# EAGLE design InkTime (EAGLE 9.7.0)

## Sheet 1 of 2
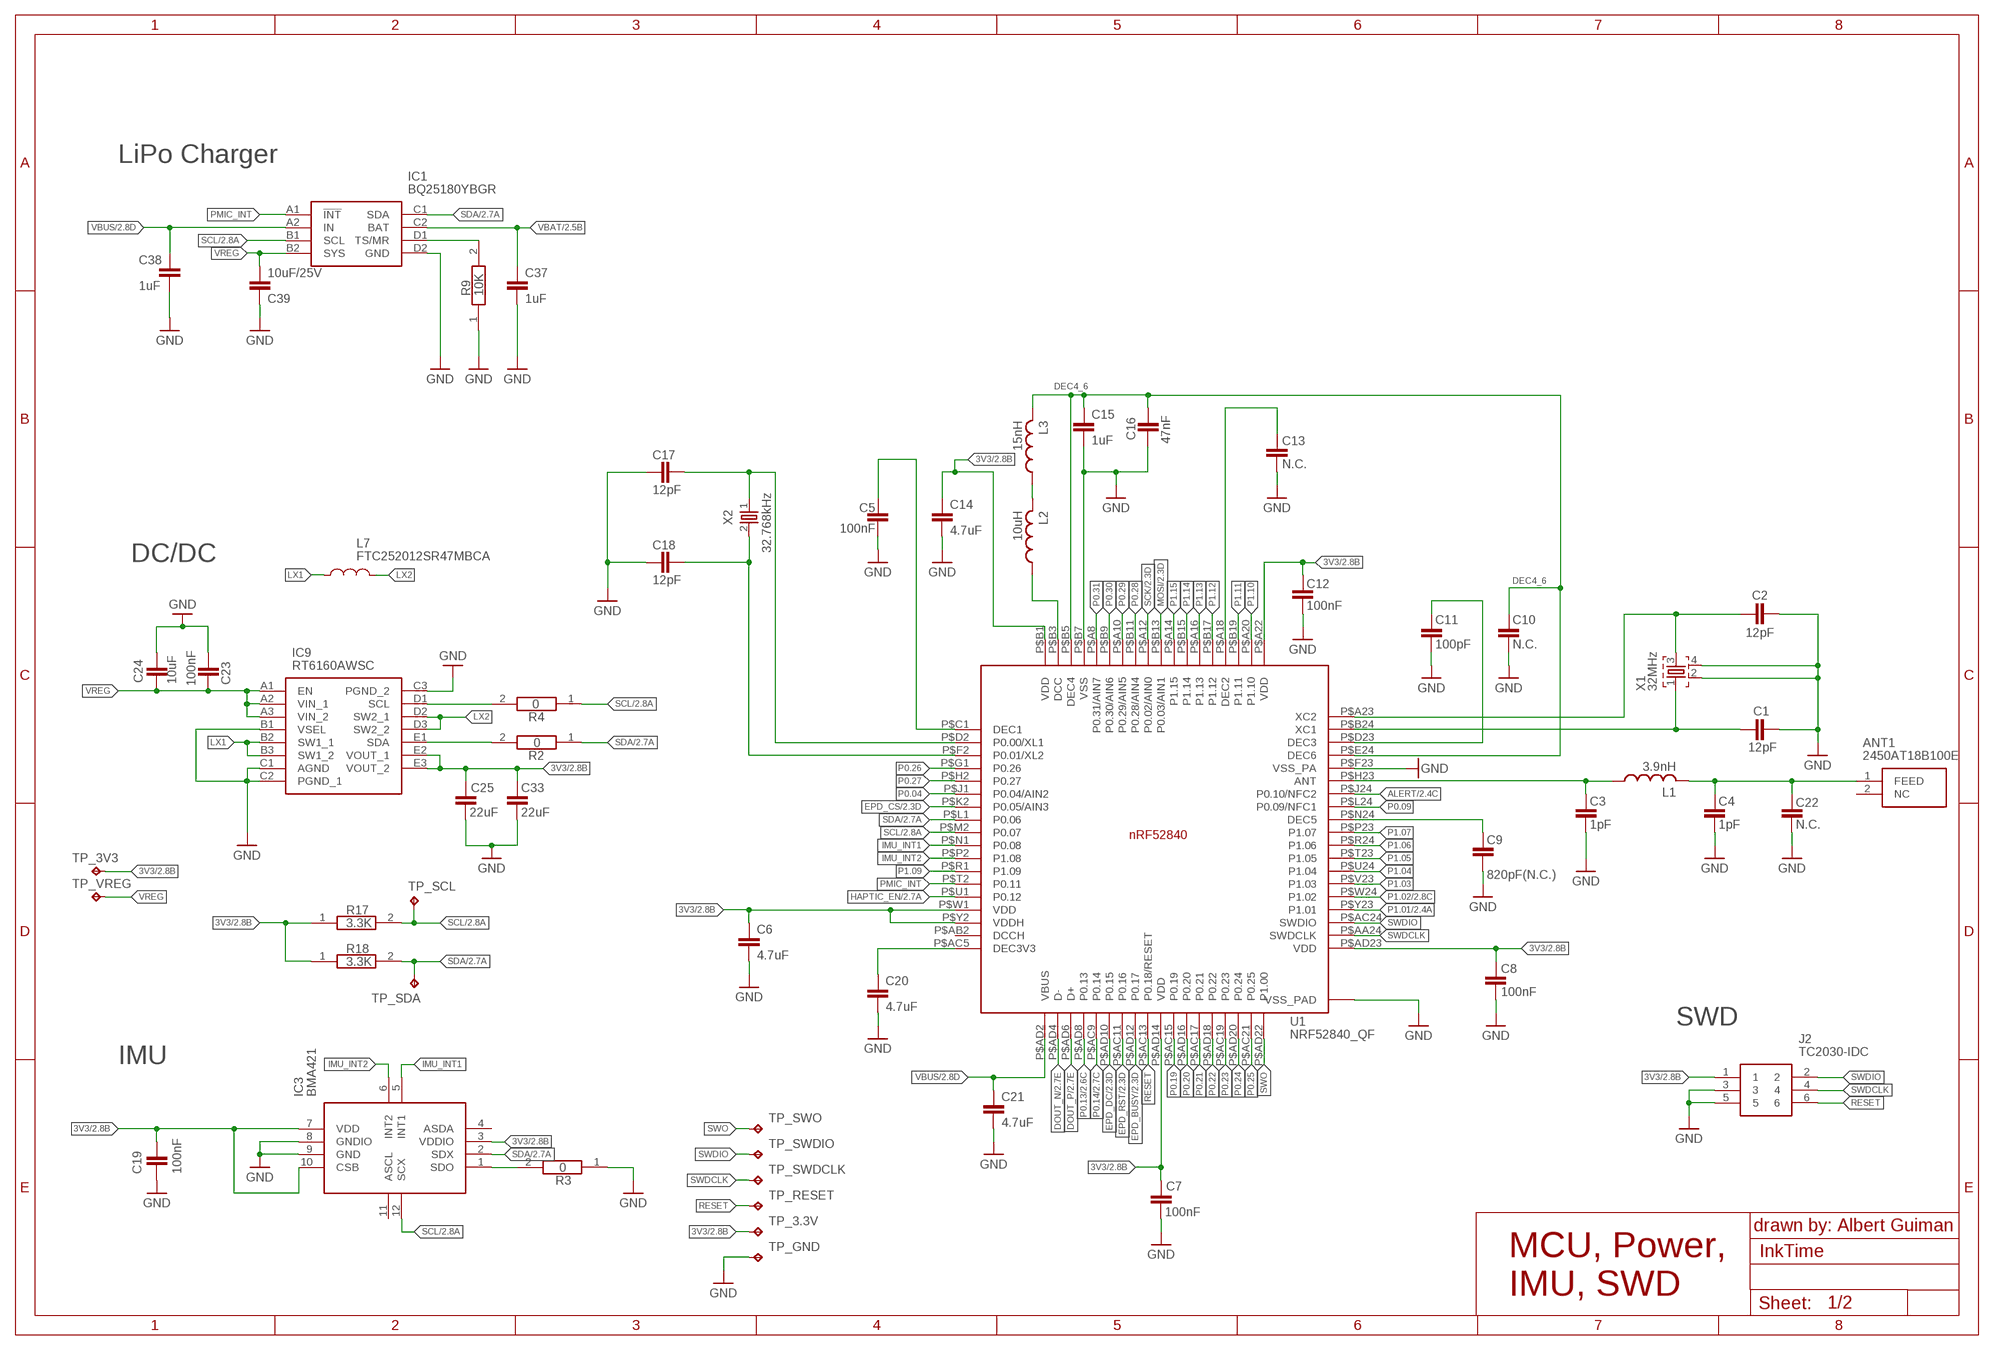
[diagram p0: schematic, sheet 1]
FRAME1 (FRAMES_A3L-LOC): A: a

### Parts
ANT1  2450AT18B100E  2450AT18B100E_2450AT18B100E  [2450AT18B100E_ANTC3216X140N]
C1  12pF  NORDIC_NRF_3_CAPACITOR_0201_N  [NORDIC_NRF_3_RESC0201_N]
C2  12pF  NORDIC_NRF_3_CAPACITOR_0201_N  [NORDIC_NRF_3_RESC0201_N]
C3  1pF  NORDIC_NRF_3_CAPACITOR_0201_N  [NORDIC_NRF_3_RESC0201_N]
C4  1pF  NORDIC_NRF_3_CAPACITOR_0201_N  [NORDIC_NRF_3_RESC0201_N]
C5  100nF  NORDIC_NRF_3_CAPACITOR_0201_N  [NORDIC_NRF_3_RESC0201_N]
C6  4.7uF  NORDIC_NRF_3_CAPACITOR_0402_N  [NORDIC_NRF_3_RESC0402_N]
C7  100nF  NORDIC_NRF_3_CAPACITOR_0201_N  [NORDIC_NRF_3_RESC0201_N]
C8  100nF  NORDIC_NRF_3_CAPACITOR_0201_N  [NORDIC_NRF_3_RESC0201_N]
C9  820pF(N.C.)  NORDIC_NRF_3_CAPACITOR_0201_N  [NORDIC_NRF_3_RESC0201_N]
C10  N.C.  NORDIC_NRF_3_CAPACITOR_0201_N  [NORDIC_NRF_3_RESC0201_N]
C11  100pF  NORDIC_NRF_3_CAPACITOR_0201_N  [NORDIC_NRF_3_RESC0201_N]
C12  100nF  NORDIC_NRF_3_CAPACITOR_0201_N  [NORDIC_NRF_3_RESC0201_N]
C13  N.C.  NORDIC_NRF_3_CAPACITOR_0201_N  [NORDIC_NRF_3_RESC0201_N]
C14  4.7uF  NORDIC_NRF_3_CAPACITOR_0402_N  [NORDIC_NRF_3_RESC0402_N]
C15  1uF  NORDIC_NRF_3_CAPACITOR_0402_N  [NORDIC_NRF_3_RESC0402_N]
C16  47nF  NORDIC_NRF_3_CAPACITOR_0201_N  [NORDIC_NRF_3_RESC0201_N]
C17  12pF  NORDIC_NRF_3_CAPACITOR_0201_N  [NORDIC_NRF_3_RESC0201_N]
C18  12pF  NORDIC_NRF_3_CAPACITOR_0201_N  [NORDIC_NRF_3_RESC0201_N]
C19  100nF  NORDIC_NRF_3_CAPACITOR_0201_N  [NORDIC_NRF_3_RESC0201_N]
C20  4.7uF  NORDIC_NRF_3_CAPACITOR_0402_N  [NORDIC_NRF_3_RESC0402_N]
C21  4.7uF  NORDIC_NRF_3_CAPACITOR_0402_N  [NORDIC_NRF_3_RESC0402_N]
C22  N.C.  NORDIC_NRF_3_CAPACITOR_0201_N  [NORDIC_NRF_3_RESC0201_N]
C23  100nF  NORDIC_NRF_3_CAPACITOR_0201_N  [NORDIC_NRF_3_RESC0201_N]
C24  10uF  NORDIC_NRF_3_CAPACITOR_0402_N  [NORDIC_NRF_3_RESC0402_N]
C25  22uF  NORDIC_NRF_3_CAPACITOR_0603_N  [NORDIC_NRF_3_RESC0603_N]
C33  22uF  NORDIC_NRF_3_CAPACITOR_0603_N  [NORDIC_NRF_3_RESC0603_N]
C37  1uF  NORDIC_NRF_3_CAPACITOR_0402_N  [NORDIC_NRF_3_RESC0402_N]
C38  1uF  NORDIC_NRF_3_CAPACITOR_0402_N  [NORDIC_NRF_3_RESC0402_N]
C39  10uF/25V  NORDIC_NRF_3_CAPACITOR_0603_N  [NORDIC_NRF_3_RESC0603_N]
IC1  BQ25180YBGR  BQ25180YBGR_BQ25180YBGR  [BQ25180YBGR_BGA8C40P2X4_100X155X50]
IC3  BMA421  BMA423_BMA423  [BMA423_BMA423]
IC9  RT6160AWSC  RT6160AWSC_RT6160AWSC  [RT6160AWSC_BGA15C40P3X5_140X230X60]
J2  TC2030-IDC  TC2030-IDC_TC2030-IDC  [TC2030-IDC_TC2030IDC]
L1  3.9nH  NORDIC_NRF_2_INDUCTOR_0201_N  [NORDIC_NRF_2_RESC0201_N]
L2  10uH  NORDIC_NRF_2_INDUCTOR_0603_N  [NORDIC_NRF_2_RESC0603_N]
L3  15nH  NORDIC_NRF_2_INDUCTOR_0402_N  [NORDIC_NRF_2_RESC0402_N]
L7  FTC252012SR47MBCA  FTC252012SR47MBCAFTC252012SR47MBCA  [FTC252012SR47MBCA]
R2  0  ERA-1AEB3401C_CPF0201D7K68C1  [ERA-1AEB3401C_0201]
R3  0  ERA-1AEB3401C_CPF0201D7K68C1  [ERA-1AEB3401C_0201]
R4  0  ERA-1AEB3401C_CPF0201D7K68C1  [ERA-1AEB3401C_0201]
R9  10K  ERA-1AEB3401C_CPF0201D7K68C1  [ERA-1AEB3401C_0201]
R17  3.3K  ERA-1AEB3401C_CPF0201D7K68C1  [ERA-1AEB3401C_0201]
R18  3.3K  ERA-1AEB3401C_CPF0201D7K68C1  [ERA-1AEB3401C_0201]
TP_3.3V  HECTOR_WATCH_1_TPTP20R  [HECTOR_WATCH_1_TP20R]
TP_3V3  HECTOR_WATCH_1_TPTP20R  [HECTOR_WATCH_1_TP20R]
TP_GND  HECTOR_WATCH_1_TPTP20R  [HECTOR_WATCH_1_TP20R]
TP_RESET  HECTOR_WATCH_1_TPTP20R  [HECTOR_WATCH_1_TP20R]
TP_SCL  HECTOR_WATCH_1_TPTP20R  [HECTOR_WATCH_1_TP20R]
TP_SDA  HECTOR_WATCH_1_TPTP20R  [HECTOR_WATCH_1_TP20R]
TP_SWDCLK  HECTOR_WATCH_1_TPTP20R  [HECTOR_WATCH_1_TP20R]
TP_SWDIO  HECTOR_WATCH_1_TPTP20R  [HECTOR_WATCH_1_TP20R]
TP_SWO  HECTOR_WATCH_1_TPTP20R  [HECTOR_WATCH_1_TP20R]
TP_VREG  HECTOR_WATCH_1_TPTP20R  [HECTOR_WATCH_1_TP20R]
U1  NRF52840_QF  NORDIC_NRF_4_NRF52840_QF  [NORDIC_NRF_4_AQFN50P700X700X85_HS-74N]
X1  32MHz  NORDIC_NRF_XTAL_32MHZ  [NORDIC_NRF_BT-XTAL_2016_N]
X2  32.768kHz  NORDIC_NRF_1_XTAL_32KHZ  [NORDIC_NRF_1_XTAL_3215_N]

### Nets
3V3 [HIGH_CURRENT]: C6.1 C7.2 C8.2 C12.2 C14.1 C19.2 C25.1 C33.1 IC3.3(VDDIO) IC3.7(VDD) IC3.10(CSB) IC9.E2(VOUT_1) IC9.E3(VOUT_2) J2.1 R17.1 R18.1 TP_3.3V.TP TP_3V3.TP U1.P$A22(VDD) U1.P$AD14(VDD) U1.P$AD23(VDD) U1.P$B1(VDD) U1.P$W1(VDD) U1.P$Y2(VDDH) ; also sheet 2
ALERT: U1.P$J24(P0.10/NFC2) ; also sheet 2
DEC4_6: C10.2 C15.1 C16.2 L3.2 U1.P$B5(DEC4) U1.P$E24(DEC6)
DOUT_N: U1.P$AD4(D-) ; also sheet 2
DOUT_P: U1.P$AD6(D+) ; also sheet 2
EPD_BUSY: U1.P$AD12(P0.17) ; also sheet 2
EPD_CS: U1.P$K2(P0.05/AIN3) ; also sheet 2
EPD_DC: U1.P$AD10(P0.15) ; also sheet 2
EPD_RST: U1.P$AC11(P0.16) ; also sheet 2
GND [GROUND]: C1.2 C2.2 C3.1 C4.1 C5.1 C6.2 C7.1 C8.1 C9.1 C10.1 C11.1 C12.1 C13.1 C14.2 C15.2 C16.1 C17.1 C18.1 C19.1 C20.2 C21.2 C22.1 C23.1 C24.1 C25.2 C33.2 C37.2 C38.2 C39.2 IC1.D2(GND) IC3.8(GNDIO) IC3.9(GND) IC9.B1(VSEL) IC9.C1(AGND) IC9.C2(PGND_1) IC9.C3(PGND_2) J2.3 J2.5 R3.1 R9.1 TP_GND.TP U1.P$74(VSS_PAD) U1.P$75(VSS_PAD) U1.P$76(VSS_PAD) U1.P$77(VSS_PAD) U1.P$78(VSS_PAD) U1.P$79(VSS_PAD) U1.P$80(VSS_PAD) U1.P$81(VSS_PAD) U1.P$82(VSS_PAD) U1.P$83(VSS_PAD) U1.P$84(VSS_PAD) U1.P$85(VSS_PAD) U1.P$86(VSS_PAD) U1.P$87(VSS_PAD) U1.P$88(VSS_PAD) U1.P$89(VSS_PAD) U1.P$90(VSS_PAD) U1.P$B7(VSS) U1.P$F23(VSS_PA) X1.2 X1.4 ; also sheet 2
HAPTIC_EN: U1.P$U1(P0.12) ; also sheet 2
IMU_INT1: IC3.5(INT1) U1.P$N1(P0.08)
IMU_INT2: IC3.6(INT2) U1.P$P2(P1.08)
LX1: IC9.B2(SW1_1) IC9.B3(SW1_2) L7.1
LX2: IC9.D2(SW2_1) IC9.D3(SW2_2) L7.2
MOSI: U1.P$B13(P0.03/AIN1) ; also sheet 2
N$3: C17.2 U1.P$D2(P0.00/XL1) X2.1
N$5: C20.1 U1.P$AC5(DEC3V3)
N$15: IC9.D1(SCL) R4.2
N$16: C18.2 U1.P$F2(P0.01/XL2) X2.2
N$17: C5.2 U1.P$C1(DEC1)
N$19: IC3.1(SDO) R3.2
N$20: IC9.E1(SDA) R2.2
N$21: L2.2 L3.1
N$22: C2.1 U1.P$A23(XC2) X1.3
N$24: IC1.D1(TS/MR) R9.2
N$25: C13.2 U1.P$A18(DEC2)
N$26: L2.1 U1.P$B3(DCC)
N$27: C11.2 U1.P$D23(DEC3)
N$28: C1.1 U1.P$B24(XC1) X1.1
N$30: C9.2 U1.P$N24(DEC5)
N$32: C3.2 L1.1 U1.P$H23(ANT)
N$33: ANT1.1(FEED) C4.2 C22.2 L1.2
P0.04: U1.P$J1(P0.04/AIN2)
P0.09: U1.P$L24(P0.09/NFC1)
P0.13: U1.P$AD8(P0.13) ; also sheet 2
P0.14: U1.P$AC9(P0.14) ; also sheet 2
P0.19: U1.P$AC15(P0.19)
P0.20: U1.P$AD16(P0.20)
P0.21: U1.P$AC17(P0.21)
P0.22: U1.P$AD18(P0.22)
P0.23: U1.P$AC19(P0.23)
P0.24: U1.P$AD20(P0.24)
P0.25: U1.P$AC21(P0.25)
P0.26: U1.P$G1(P0.26)
P0.27: U1.P$H2(P0.27)
P0.28: U1.P$B11(P0.28/AIN4)
P0.29: U1.P$A10(P0.29/AIN5)
P0.30: U1.P$B9(P0.30/AIN6)
P0.31: U1.P$A8(P0.31/AIN7)
P1.01: U1.P$Y23(P1.01) ; also sheet 2
P1.02: U1.P$W24(P1.02) ; also sheet 2
P1.03: U1.P$V23(P1.03)
P1.04: U1.P$U24(P1.04)
P1.05: U1.P$T23(P1.05)
P1.06: U1.P$R24(P1.06)
P1.07: U1.P$P23(P1.07)
P1.09: U1.P$R1(P1.09)
P1.10: U1.P$A20(P1.10)
P1.11: U1.P$B19(P1.11)
P1.12: U1.P$B17(P1.12)
P1.13: U1.P$A16(P1.13)
P1.14: U1.P$B15(P1.14)
P1.15: U1.P$A14(P1.15)
PMIC_INT: IC1.A1(!INT) U1.P$T2(P0.11)
RESET: J2.6 TP_RESET.TP U1.P$AC13(P0.18/RESET)
SCK: U1.P$A12(P0.02/AIN0) ; also sheet 2
SCL: IC1.B1(SCL) IC3.12(SCX) R4.1 R17.2 TP_SCL.TP U1.P$M2(P0.07) ; also sheet 2
SDA: IC1.C1(SDA) IC3.2(SDX) R2.1 R18.2 TP_SDA.TP U1.P$L1(P0.06) ; also sheet 2
SWDCLK: J2.4 TP_SWDCLK.TP U1.P$AA24(SWDCLK)
SWDIO: J2.2 TP_SWDIO.TP U1.P$AC24(SWDIO)
SWO: TP_SWO.TP U1.P$AD22(P1.00)
VBAT [HIGH_CURRENT]: C37.1 IC1.C2(BAT) ; also sheet 2
VBUS [HIGH_CURRENT]: C21.1 C38.1 IC1.A2(IN) U1.P$AD2(VBUS) ; also sheet 2
VREG [HIGH_CURRENT]: C23.2 C24.2 C39.1 IC1.B2(SYS) IC9.A1(EN) IC9.A2(VIN_1) IC9.A3(VIN_2) TP_VREG.TP
Unconnected: ANT1.2(NC) IC3.4(ASDA) IC3.11(ASCL) U1.P$AB2(DCCH)

### Notes on the sheet
- LiPo Charger
- DC/DC
- SWD
- IMU
- drawn by: Albert Guiman
- MCU, Power,
  IMU, SWD

## Sheet 2 of 2
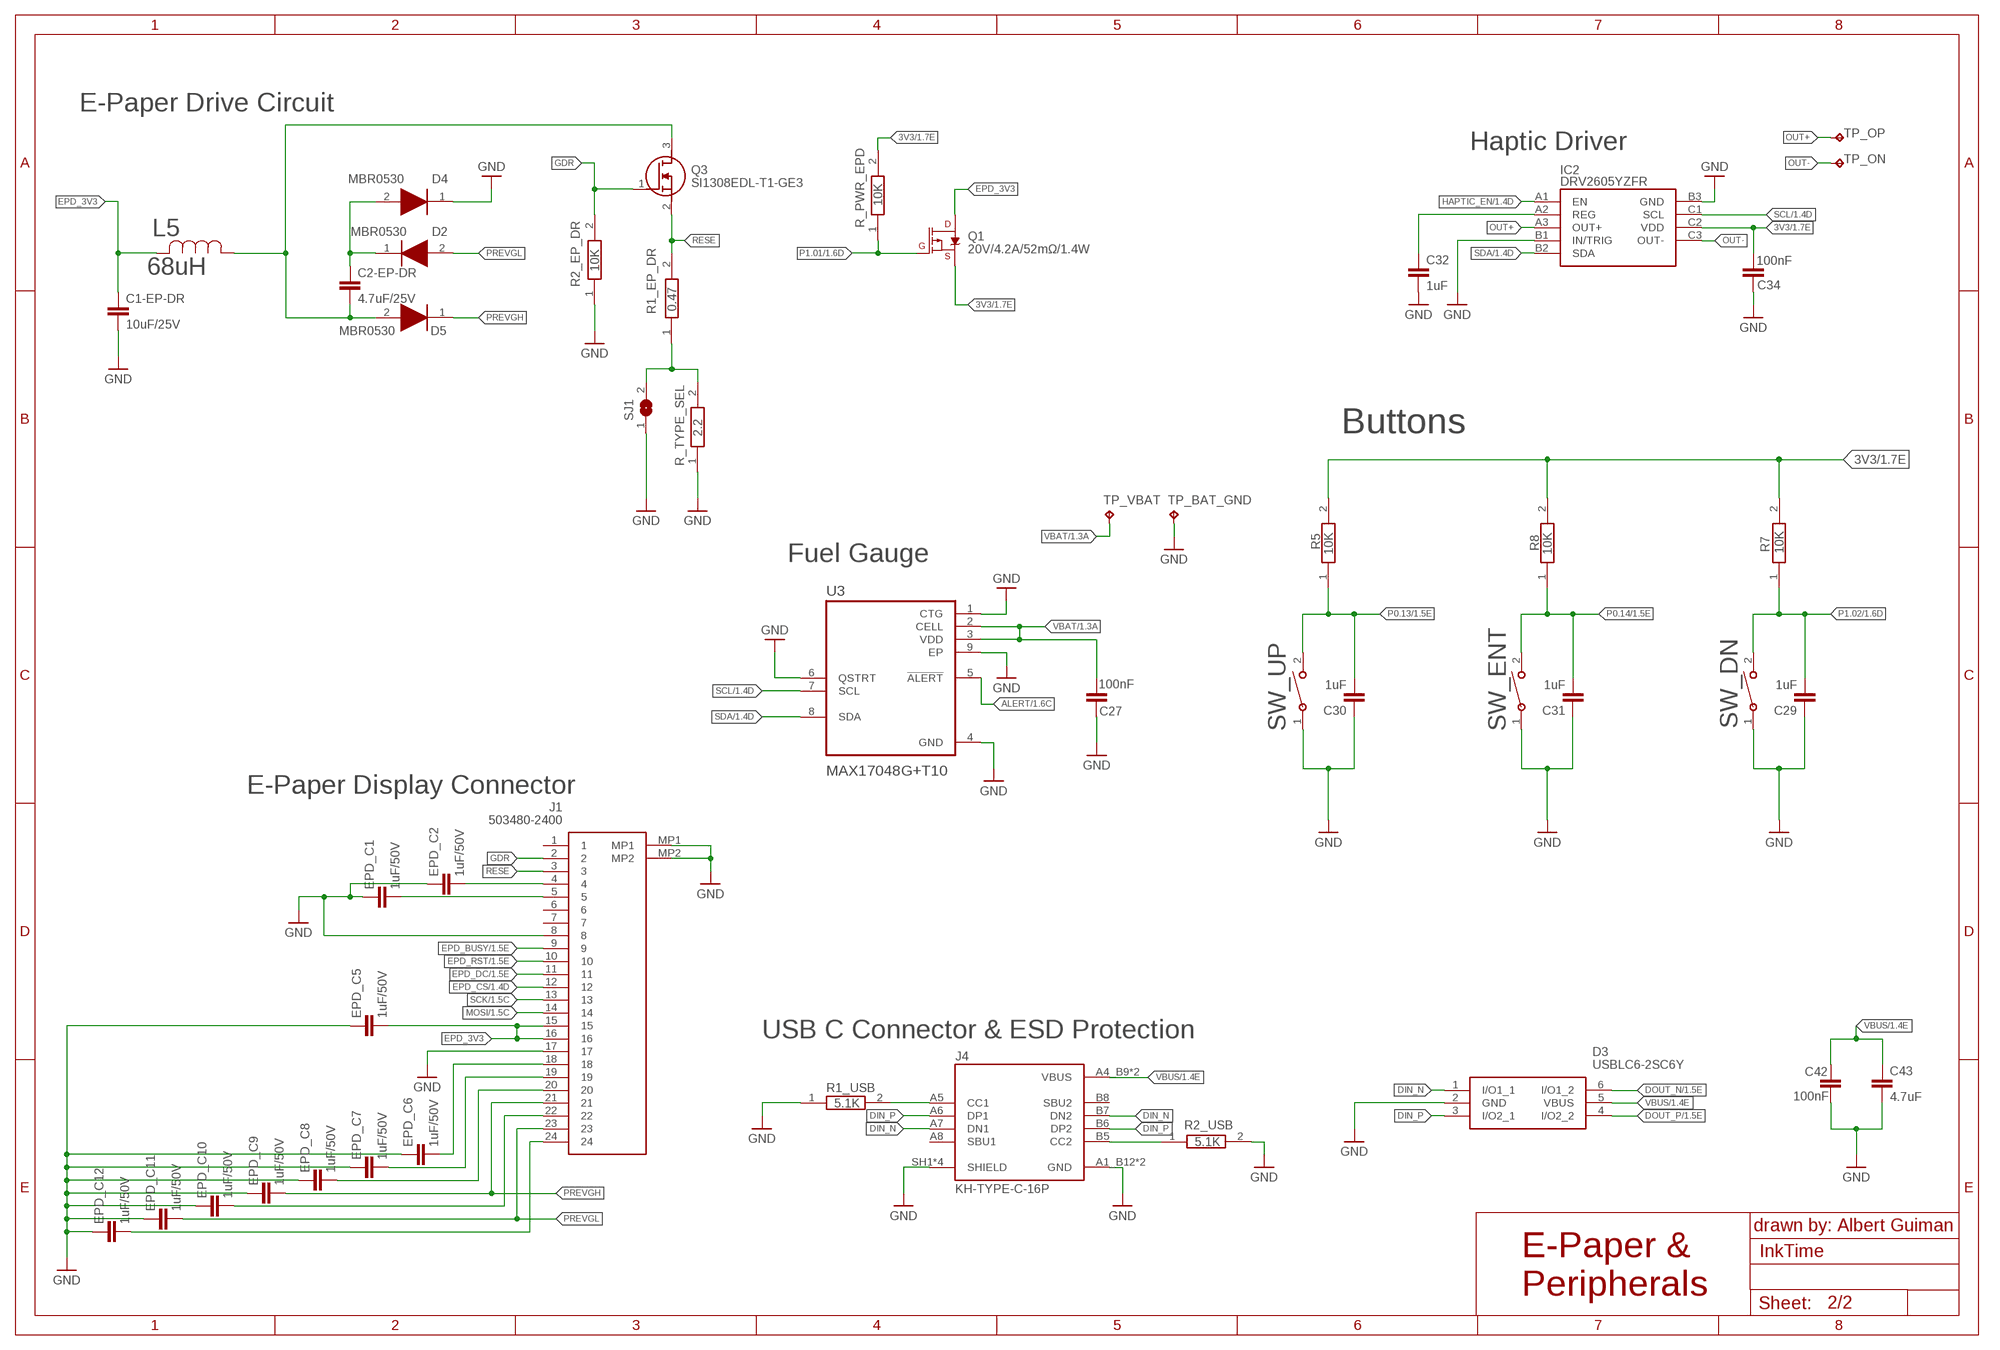
[diagram p1: schematic, sheet 2]

### Parts
C1-EP-DR  10uF/25V  NORDIC_NRF_3_CAPACITOR_0603_N  [NORDIC_NRF_3_RESC0603_N]
C2-EP-DR  4.7uF/25V  PERFECT_0402_CAP_0402  [PERFECT_0402_0402]
C27  100nF  NORDIC_NRF_3_CAPACITOR_0201_N  [NORDIC_NRF_3_RESC0201_N]
C29  1uF  PERFECT_0402_CAP_0402  [PERFECT_0402_0402]
C30  1uF  PERFECT_0402_CAP_0402  [PERFECT_0402_0402]
C31  1uF  PERFECT_0402_CAP_0402  [PERFECT_0402_0402]
C32  1uF  PERFECT_0402_CAP_0402  [PERFECT_0402_0402]
C34  100nF  NORDIC_NRF_3_CAPACITOR_0201_N  [NORDIC_NRF_3_RESC0201_N]
C42  100nF  NORDIC_NRF_3_CAPACITOR_0201_N  [NORDIC_NRF_3_RESC0201_N]
C43  4.7uF  PERFECT_0402_CAP_0402  [PERFECT_0402_0402]
D2  MBR0530  ESP32_C6_LIBRARY_5_MBR0530  [ESP32_C6_LIBRARY_5_SOD3716X135N]
D3  USBLC6-2SC6Y  ESP32_C6_LIBRARY_3_USBLC6-2SC6Y  [ESP32_C6_LIBRARY_3_SOT95P280X145-6N]
D4  MBR0530  ESP32_C6_LIBRARY_5_MBR0530  [ESP32_C6_LIBRARY_5_SOD3716X135N]
D5  MBR0530  ESP32_C6_LIBRARY_5_MBR0530  [ESP32_C6_LIBRARY_5_SOD3716X135N]
EPD_C1  1uF/50V  PERFECT_0402_CAP_0402  [PERFECT_0402_0402]
EPD_C2  1uF/50V  PERFECT_0402_CAP_0402  [PERFECT_0402_0402]
EPD_C5  1uF/50V  PERFECT_0402_CAP_0402  [PERFECT_0402_0402]
EPD_C6  1uF/50V  PERFECT_0402_CAP_0402  [PERFECT_0402_0402]
EPD_C7  1uF/50V  PERFECT_0402_CAP_0402  [PERFECT_0402_0402]
EPD_C8  1uF/50V  PERFECT_0402_CAP_0402  [PERFECT_0402_0402]
EPD_C9  1uF/50V  PERFECT_0402_CAP_0402  [PERFECT_0402_0402]
EPD_C10  1uF/50V  PERFECT_0402_CAP_0402  [PERFECT_0402_0402]
EPD_C11  1uF/50V  PERFECT_0402_CAP_0402  [PERFECT_0402_0402]
EPD_C12  1uF/50V  PERFECT_0402_CAP_0402  [PERFECT_0402_0402]
IC2  DRV2605YZFR  DRV2605YZFR_DRV2605YZFR  [DRV2605YZFR_BGA9C50P3X3_144X144X62]
J1  503480-2400  503480-2400_503480-2400  [503480-2400_5034802400]
J4  KH-TYPE-C-16P  KH-TYPE-C-16P_KH-TYPE-C-16P  [KH-TYPE-C-16P_KINGHELM_KH-TYPE-C-16P]
L5  68uH  ESP32_C6_LIBRARY_2_744043680IND_4828-WE-TPC_WRE  [ESP32_C6_LIBRARY_2_IND_4828-WE-TPC_WRE]
Q1  20V/4.2A/52mΩ/1.4W  ESP32_C6_LIBRARY_4_ESP32_WROVER_SPARKFUN-DISCRETESEMI_MOSFET_PCH-DMG2305UX-7  [ESP32_C6_LIBRARY_4_ESP32_C6_LIBRARY_4_ESP32_C6_LIBRARY_4_ESP32_C6_LIBRARY_4_ESP32_WROVER_SPARKFUN-DISCRETESEMI_SOT23-3]
Q3  SI1308EDL-T1-GE3  ESP32_C6_LIBRARY_6_SI1308EDL-T1-GE3  [ESP32_C6_LIBRARY_6_SOT65P210X110-3N]
R1_EP_DR  0.47  ERA-1AEB3401C_CPF0201D7K68C1  [ERA-1AEB3401C_0201]
R1_USB  5.1K  ERA-1AEB3401C_CPF0201D7K68C1  [ERA-1AEB3401C_0201]
R2_EP_DR  10K  ERA-1AEB3401C_CPF0201D7K68C1  [ERA-1AEB3401C_0201]
R2_USB  5.1K  ERA-1AEB3401C_CPF0201D7K68C1  [ERA-1AEB3401C_0201]
R5  10K  ERA-1AEB3401C_CPF0201D7K68C1  [ERA-1AEB3401C_0201]
R7  10K  ERA-1AEB3401C_CPF0201D7K68C1  [ERA-1AEB3401C_0201]
R8  10K  ERA-1AEB3401C_CPF0201D7K68C1  [ERA-1AEB3401C_0201]
R_PWR_EPD  10K  ERA-1AEB3401C_CPF0201D7K68C1  [ERA-1AEB3401C_0201]
R_TYPE_SEL  2.2  ERA-1AEB3401C_CPF0201D7K68C1  [ERA-1AEB3401C_0201]
SJ1  ESP32_C6_LIBRARY_7_JUMPER_SJ  [ESP32_C6_LIBRARY_7_JUMPER_SJ]
SW_DN  2025-10-22_07-23-44_LIBRARY_EVP-AKE31ASW_EVP-AKE31A_PAN  [2025-10-22_07-23-44_LIBRARY_SW_EVP-AKE31A_PAN]
SW_ENT  2025-10-22_07-23-44_LIBRARY_EVP-AKE31ASW_EVP-AKE31A_PAN  [2025-10-22_07-23-44_LIBRARY_SW_EVP-AKE31A_PAN]
SW_UP  2025-10-22_07-23-44_LIBRARY_EVP-AKE31ASW_EVP-AKE31A_PAN  [2025-10-22_07-23-44_LIBRARY_SW_EVP-AKE31A_PAN]
TP_BAT_GND  HECTOR_WATCH_1_TPTP20R  [HECTOR_WATCH_1_TP20R]
TP_ON  HECTOR_WATCH_1_TPTP20R  [HECTOR_WATCH_1_TP20R]
TP_OP  HECTOR_WATCH_1_TPTP20R  [HECTOR_WATCH_1_TP20R]
TP_VBAT  HECTOR_WATCH_1_TPTP20R  [HECTOR_WATCH_1_TP20R]
U3  MAX17048G+T10  ESP32_C6_LIBRARY_MAX17048G+T10  [ESP32_C6_LIBRARY_SON50P200X200X80-9N]

### Nets
3V3 [HIGH_CURRENT]: C34.2 IC2.C2(VDD) Q1.2(S) R5.2 R7.2 R8.2 R_PWR_EPD.2 ; also sheet 1
ALERT: U3.5(!ALERT) ; also sheet 1
DIN_N: D3.1(I/O1_1) J4.A7(DN1) J4.B7(DN2)
DIN_P: D3.3(I/O2_1) J4.A6(DP1) J4.B6(DP2)
DOUT_N: D3.6(I/O1_2) ; also sheet 1
DOUT_P: D3.4(I/O2_2) ; also sheet 1
EPD_3V3 [HIGH_CURRENT]: C1-EP-DR.1 EPD_C5.2 J1.15 J1.16 L5.2 Q1.3(D)
EPD_BUSY: J1.9 ; also sheet 1
EPD_CS: J1.12 ; also sheet 1
EPD_DC: J1.11 ; also sheet 1
EPD_RST: J1.10 ; also sheet 1
GDR: J1.2 Q3.1(G) R2_EP_DR.2
GND [GROUND]: C1-EP-DR.2 C27.1 C29.1 C30.1 C31.1 C32.2 C34.1 C42.2 C43.2 D3.2(GND) D4.1(K) EPD_C1.1 EPD_C2.1 EPD_C5.1 EPD_C6.1 EPD_C7.1 EPD_C8.1 EPD_C9.1 EPD_C10.1 EPD_C11.1 EPD_C12.1 IC2.B1(IN/TRIG) IC2.B3(GND) J1.8 J1.17 J1.MP1 J1.MP2 J4.A1_B12(GND) J4.A12_B1(GND) J4.SH1(SHIELD) J4.SH2(SHIELD) J4.SH3(SHIELD) J4.SH4(SHIELD) R1_USB.1 R2_EP_DR.1 R2_USB.2 R_TYPE_SEL.1 SJ1.1 SW_DN.1 SW_ENT.1 SW_UP.1 TP_BAT_GND.TP U3.1(CTG) U3.4(GND) U3.6(QSTRT) U3.9(EP) ; also sheet 1
HAPTIC_EN: IC2.A1(EN) ; also sheet 1
MOSI: J1.14 ; also sheet 1
N$1: J4.A5(CC1) R1_USB.2
N$2: EPD_C12.2 J1.24
N$4: EPD_C2.2 J1.4
N$6: EPD_C1.2 J1.5
N$7: EPD_C10.2 J1.22
N$8: J4.B5(CC2) R2_USB.1
N$9: C32.1 IC2.A2(REG)
N$10: EPD_C8.2 J1.20
N$11: EPD_C7.2 J1.19
N$12: EPD_C6.2 J1.18
N$13: C2-EP-DR.2 D5.2(A) L5.1 Q3.3(D)
N$14: C2-EP-DR.1 D2.1(K) D4.2(A)
N$18: R1_EP_DR.1 R_TYPE_SEL.2 SJ1.2
OUT+: IC2.A3(OUT+) TP_OP.TP
OUT-: IC2.C3(OUT-) TP_ON.TP
P0.13: C30.2 R5.1 SW_UP.2 ; also sheet 1
P0.14: C31.2 R8.1 SW_ENT.2 ; also sheet 1
P1.01: Q1.1(G) R_PWR_EPD.1 ; also sheet 1
P1.02: C29.2 R7.1 SW_DN.2 ; also sheet 1
PREVGH: D5.1(K) EPD_C9.2 J1.21
PREVGL: D2.2(A) EPD_C11.2 J1.23
RESE: J1.3 Q3.2(S) R1_EP_DR.2
SCK: J1.13 ; also sheet 1
SCL: IC2.C1(SCL) U3.7(SCL) ; also sheet 1
SDA: IC2.B2(SDA) U3.8(SDA) ; also sheet 1
VBAT [HIGH_CURRENT]: C27.2 TP_VBAT.TP U3.2(CELL) U3.3(VDD) ; also sheet 1
VBUS [HIGH_CURRENT]: C42.1 C43.1 D3.5(VBUS) J4.A4_B9(VBUS) J4.A9_B4(VBUS) ; also sheet 1
Unconnected: J1.1 J1.6 J1.7 J4.A8(SBU1) J4.B8(SBU2)

### Notes on the sheet
- E-Paper Drive Circuit
- Haptic Driver
- Buttons
- Fuel Gauge
- E-Paper Display Connector
- USB C Connector & ESD Protection
- drawn by: Albert Guiman
- E-Paper &
  Peripherals

## Library data of the parts
ANT1 = InkTime_v5:2450AT18B100E_2450AT18B100E: Antennas 2.45GHz ANTENNA Source: Datasheet <https://www.johansontechnology.com/datasheets/2450AT18B100/2450AT18B100.pdf>
C1 C1-EP-DR C2-C25 C27 C33 C34 C37-C39 C42 = InkTime_v5:NORDIC_NRF_3_CAPACITOR: Generic chip capacitor
C2-EP-DR C29-C32 C43 EPD_C1 EPD_C2 EPD_C5-EPD_C12 = InkTime_v5:PERFECT_0402_CAP_0402: 0402 (1005 Metric) Nick Garner - TeleSense
D2 D4 D5 = InkTime_v5:ESP32_C6_LIBRARY_5_MBR0530: ON SEMICONDUCTOR - MBR0530 - DIODE, SCHOTTKY, 0.5A, 30V, SOD-123 Source: Datasheet <http://www.onsemi.com/pub/Collateral/MBR0530T1-D.PDF> Check availability <https://pricing.snapeda.com/parts/MBR0530/ON%20Semiconductor/view-part?ref=eda>
D3 = InkTime_v5:ESP32_C6_LIBRARY_3_USBLC6-2SC6Y: Low Cap. ESD Protection Auto SOT-23-6 STMicroelectronics USBLC6-2SC6Y, Dual Uni-Directional TVS Diode Array, 6-Pin SOT-23 Source: Datasheet <https://componentsearchengine.com/Datasheets/1/USBLC6-2SC6Y.pdf> Check availability <https://pricing.snapeda.com/parts/USBLC6-2SC6Y/STMicroelectronics/view-part?ref=eda>
IC1 = InkTime_v5:BQ25180YBGR_BQ25180YBGR: Charger IC Lithium Ion/Polymer, Lithium Iron Phosphate 8-DSBGA (1.6x1.1) Source: Datasheet <https://www.ti.com/lit/ds/symlink/bq25180.pdf?ts=1650264094470&ref_url=https%3A%2F%2Fwww.ti.com%2Fproduct%2FBQ25180>
IC2 = InkTime_v5:DRV2605YZFR_DRV2605YZFR: Haptic Driver for ERM/LRA with Built-In Library and Smart Loop Architecture Source: Datasheet <http://www.ti.com/lit/gpn/drv2605>
IC3 = InkTime_v5:BMA423_BMA423: Accelerometers Triaxial low-g 12bit Acceleration Sensor Source: Datasheet <https://www.mouser.com/datasheet/2/783/BST-BMA423-DS000-1509600.pdf>
IC9 = InkTime_v5:RT6160AWSC_RT6160AWSC: Buck-Boost Regulator Positive Output Step-Up/Step-Down I2C DC-DC Controller IC 15-WL-CSP (BSC) (1.4x2.3) Source: Datasheet <https://www.richtek.com/SaveDownload.aspx?specid=RT6160A>
J1 = InkTime_v5:503480-2400_503480-2400: FFC & FPC Connectors 0.5mm FPC RA SMT Dual Contact 24Ckt Source: Datasheet <https://componentsearchengine.com/Datasheets/1/503480-2400.pdf>
J2 = InkTime_v5:TC2030-IDC_TC2030-IDC: CABLE ADAPTER 6 POS Source: Datasheet <https://datasheet.datasheetarchive.com/originals/distributors/Datasheets_SAMA/62bc384e093448baaaa63dbd0b9d8707.pdf>
J4 = InkTime_v5:KH-TYPE-C-16P_KH-TYPE-C-16P: Check availability <https://pricing.snapeda.com/parts/KH-TYPE-C-16P/kinghelm/view-part?ref=eda>
L1-L3 = InkTime_v5:NORDIC_NRF_2_INDUCTOR: Generic chip inductor
L5 = InkTime_v5:ESP32_C6_LIBRARY_2_744043680
L7 = InkTime_v5:FTC252012SR47MBCA
Q1 = InkTime_v5:ESP32_C6_LIBRARY_4_ESP32_WROVER_SPARKFUN-DISCRETESEMI_MOSFET_PCH: P-channel MOSFETs Voltage controlled devices that allow control of high current outputs. SparkFun Products: SparkFun ESP32 Thing <https://www.sparkfun.com/products/13907> SparkFun ESP8266 Thing <https://www.sparkfun.com/products/13231> SparkFun Pi Servo HAT V2 <https://www.sparkfun.com/products/15316> DMG2305UX-7 (20V/4.2A/SOT23-3)
Q3 = InkTime_v5:ESP32_C6_LIBRARY_6_SI1308EDL-T1-GE3: MOSFET N-Ch 30V 1.5A TrenchFET SC70 Vishay Si1308EDL-T1-GE3 N-channel MOSFET Transistor, 1.5 A, 30 V, 3-Pin SC-70 Source: Datasheet <https://componentsearchengine.com/Datasheets/1/SI1308EDL-T1-GE3.pdf> Check availability <https://pricing.snapeda.com/parts/SI1308EDL-T1-GE3/Vishay%20Siliconix/view-part?ref=eda>
R1_EP_DR R1_USB R2 R2_EP_DR R2_USB R3-R5 R7-R9 R17 R18 R_PWR_EPD R_TYPE_SEL = InkTime_v5:ERA-1AEB3401C_CPF0201D7K68C1: 7.68k 0201 Thin Film Surface Mount Fixed Resistor +/-0.5% 0.031W CPF0201D7K68C1 Source: Datasheet <http://www.te.com/commerce/DocumentDelivery/DDEController?Action=showdoc&DocId=Data Sheet1773200-1ApdfEnglishENG_DS_1773200-1_A.pdf4-2176215-6>
SJ1 = InkTime_v5:ESP32_C6_LIBRARY_7_JUMPER_SJ: SMD solder JUMPER
SW_DN SW_ENT SW_UP = InkTime_v5:2025-10-22_07-23-44_LIBRARY_EVP-AKE31A
TP_3.3V TP_3V3 TP_BAT_GND TP_GND TP_ON TP_OP TP_RESET TP_SCL TP_SDA TP_SWDCLK TP_SWDIO TP_SWO TP_VBAT TP_VREG = InkTime_v5:HECTOR_WATCH_1_TP: Test pad
U1 = InkTime_v5:NORDIC_NRF_4_NRF52840_QF: nRF52840 Features Advanced Single chip 2.4 GHz multi-protocol SoC 32-bit ARM Cortex-M4F Processor 1.7v to 5.5v operation 1MB flash + 256kB RAM Bluetooth 5 support for long range and high throughput 802.15.4 radio support On-chip NFC PPI –Programmable Peripheral Interconnect Automated power management system with automatic power management of each peripheral Configurable I/O mapping for analog and digital I/O 48 x GPIO 1 x QSPI 4 x Master/Slave SPI 2 x Two-wire interface (I²C) I²S interface 2 x UART 4 x PWM USB 2.0 controller ARM TrustZone CryptoCell-310 Cryptographic and security module AES 128-bit ECB/CCM/AAR hardware accelerator Digital microphone interface (PDM) Quadrature decoder 12-bit ADC Low power comparator On-chip 50Ω balun On-air compatible with nRF52, nRF51 and nRF24 Series Applications Advanced high performance wearables Wearables for secure payments Virtual Reality/Augmented Reality systems Smart Home sensor networks Smart city sensor networks High performance HID controllers Internet of Things (IoT) sensor networks Smart door locks Smart lighting networks Connected white goods
U3 = InkTime_v5:ESP32_C6_LIBRARY_MAX17048G+T10: Check availability <https://pricing.snapeda.com/parts/MAX17048G%2BT10/Analog%20Devices/view-part?ref=eda>
X1 = InkTime_v5:NORDIC_NRF_XTAL_32MHZ
X2 = InkTime_v5:NORDIC_NRF_1_XTAL_32KHZ

## Net classes
0 default: width 0.15 mm
1 HIGH_CURRENT: width 0.1 mm
2 GROUND: width 0.1 mm

## Board
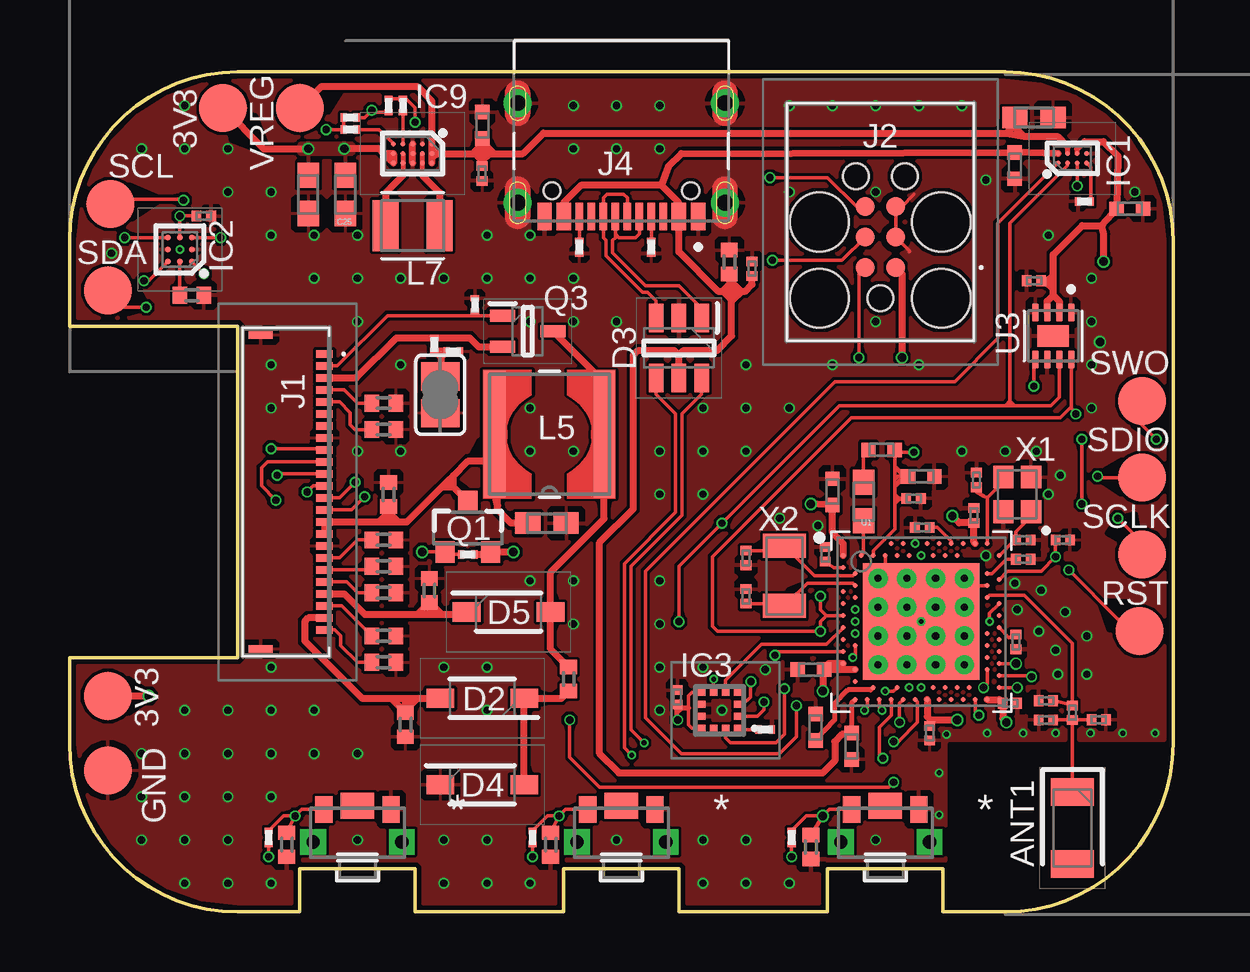
[diagram p2: board, top side]
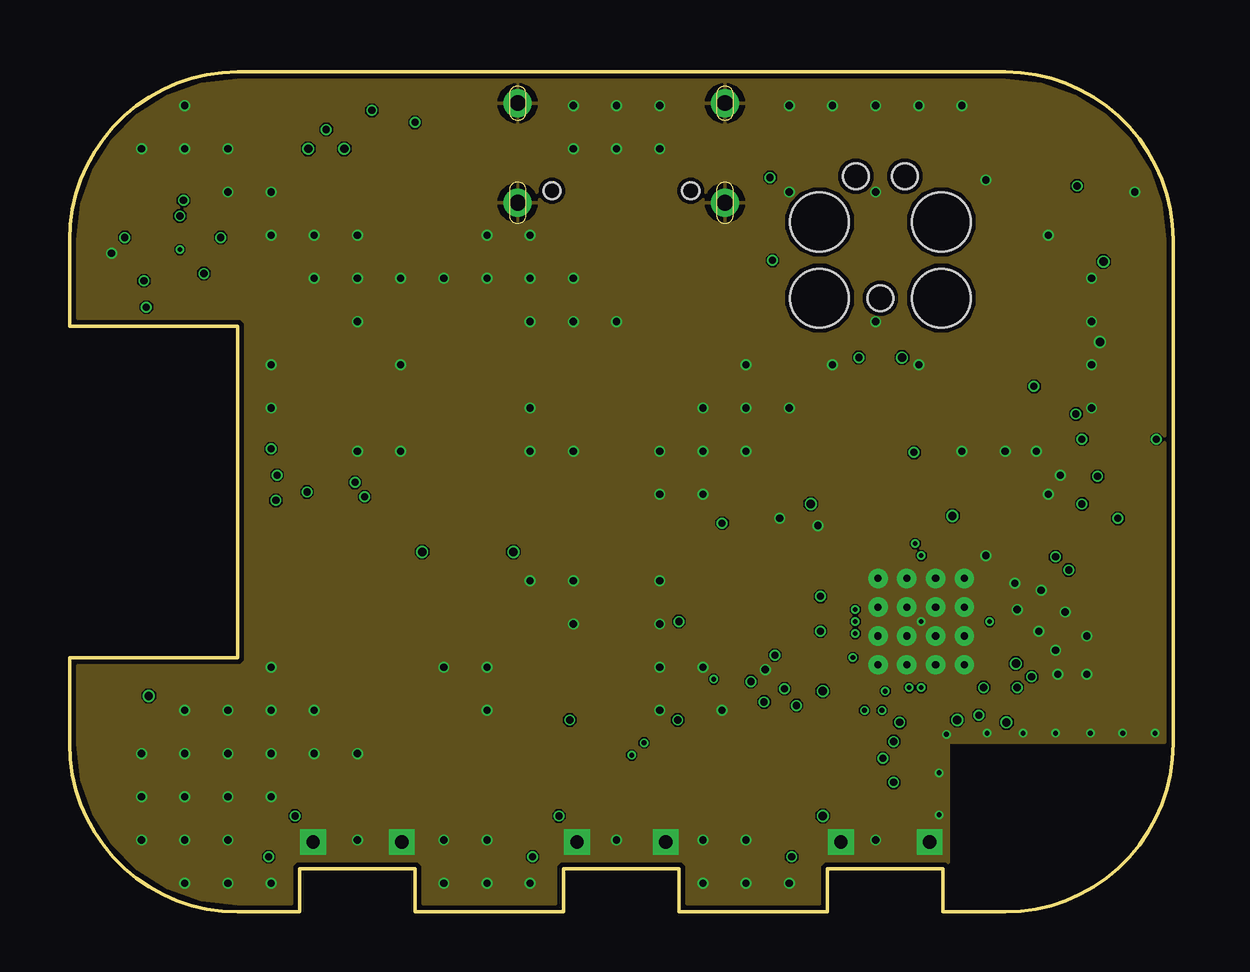
[diagram p3: board, inner layer GND]
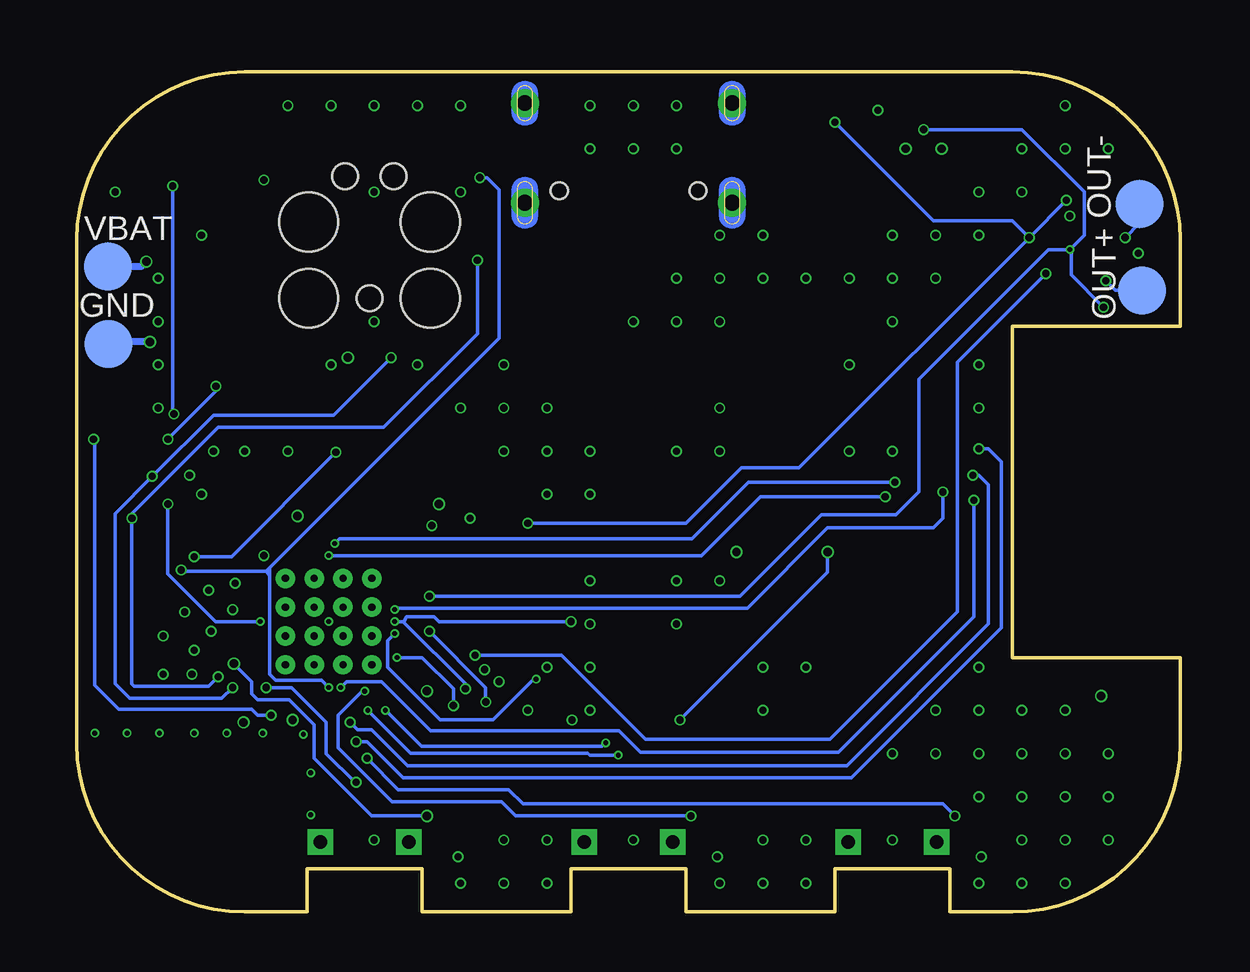
[diagram p4: board, bottom side, seen from below]

Size 46 x 35 mm. Coordinates in mm from the lower left corner, seen from the top.
Outline: 39,0 36.4,0 36.4,1.8 31.6,1.8 31.6,0 25.4,0 25.4,1.8 20.6,1.8 20.6,0 14.4,0 14.4,1.8 9.6,1.8 9.6,0 7,0 arc-90 0,7 0,10.6 7,10.6 7,24.4 0,24.4 0,28 arc-90 7,35 39,35 arc-90 46,28 46,7 arc-90 39,0
Copper layers (1+2*63+16): Top / GND / Bottom / layer 63
Stack-up 4 Layer Stack: Top SilkScreen Epoxy Ink / Top SolderMask User Defined 0.02mm Dk 4.3 / Top Surface Finish Lead-Free 0.02mm / Top User Defined 0.03mm / Dielectric-1 User Defined 0.034mm / Dielectric-2 User Defined 0.034mm / GND User Defined 0.03mm / Dielectric-3 User Defined 0.664mm / Power User Defined 0.03mm / Dielectric-4 User Defined 0.034mm / Dielectric-5 User Defined 0.034mm / Bottom User Defined 0.03mm / Bottom Surface Finish Lead-Free 0.02mm / Bottom SolderMask User Defined 0.02mm Dk 4.3 / Bottom SilkScreen Epoxy Ink
Design rules: minimum copper width classes=0 0.15mm, minimum copper width classes=1 0.1mm, minimum copper width classes=2 0.1mm, minimum copper width 0.15mm, minimum drill size 0.2mm, copper clearance wire_polygon to wire_polygon 5mil, copper clearance wire_polygon to pad_smd 5mil, copper clearance wire_polygon to via 5mil, copper clearance pad_smd to pad_smd 5mil, copper clearance pad_smd to via 5mil, copper clearance via to via 5mil, copper clearance smd to pad (same net) 5mil, copper clearance smd to via (same net) 5mil, copper clearance smd to smd (same net) 5mil, dimension clearance 0.2mm, via restrict clearance 0mil, restrict clearance 0.1mm, drill distance 6mil, keepout clearance 0mil
ComponentExcludeTop: area 36.7,0 to 46,7
ComponentExcludeBottom: area 36.7,0 to 46,7
RestrictTop: area 36.7,0 to 46,7
RestrictBottom: area 36.7,0 to 46,7
RestrictVias: area 36.7,0 to 46,7

### Footprints (pad centres in the part's own frame; a part is rotated, then mirrored left to right if it is on the bottom)
2450AT18B100E_ANTC3216X140N = smd 1.15 x 1.8: 1 -1.5,0; 2 1.5,0
NORDIC_NRF_3_RESC0201_N = smd 0.4 x 0.45: 1 -0.305,0; 2 0.305,0
NORDIC_NRF_3_RESC0603_N = smd 1.05 x 0.9: 1 -0.8,0; 2 0.8,0
PERFECT_0402_0402 = smd 0.6 x 0.7: 1 -0.5,0; 2 0.5,0
NORDIC_NRF_3_RESC0402_N = smd 0.6 x 0.6: 1 -0.55,0; 2 0.55,0
ESP32_C6_LIBRARY_5_SOD3716X135N = smd 1.15 x 0.8: 1 -1.75,0; 2 1.75,0
ESP32_C6_LIBRARY_3_SOT95P280X145-6N = smd 1.2 x 0.6: 1 -1.25,0.95; 2 -1.25,0; 3 -1.25,-0.95; 4 1.25,-0.95; 5 1.25,0; 6 1.25,0.95
BQ25180YBGR_BGA8C40P2X4_100X155X50 = smd 0.2 x 0.2: A1 -0.2,0.6; A2 0.2,0.6; B1 -0.2,0.2; B2 0.2,0.2; C1 -0.2,-0.2; C2 0.2,-0.2; D1 -0.2,-0.6; D2 0.2,-0.6
DRV2605YZFR_BGA9C50P3X3_144X144X62 = smd 0.25 x 0.25: A1 -0.5,0.5; A2 0,0.5; A3 0.5,0.5; B1 -0.5,0; B2 0,0; B3 0.5,0; C1 -0.5,-0.5; C2 0,-0.5; C3 0.5,-0.5
BMA423_BMA423 = smd 0.3 x 0.35: 1 -0.75,-0.775; 2 -0.25,-0.775; 3 0.25,-0.775; 4 0.75,-0.775; 7 0.75,0.775; 8 0.25,0.775; 9 -0.25,0.775; 10 -0.75,0.775 | smd 0.35 x 0.3: 5 0.775,-0.25; 6 0.775,0.25; 11 -0.775,0.25; 12 -0.775,-0.25
RT6160AWSC_BGA15C40P3X5_140X230X60 = smd 0.216 x 0.216: A1 -0.4,0.8; A2 0,0.8; A3 0.4,0.8; B1 -0.4,0.4; B2 0,0.4; B3 0.4,0.4; C1 -0.4,0; C2 0,0; C3 0.4,0; D1 -0.4,-0.4; D2 0,-0.4; D3 0.4,-0.4; E1 -0.4,-0.8; E2 0,-0.8; E3 0.4,-0.8
503480-2400_5034802400 = smd 0.3 x 0.7: 1 -5.75,1.525; 2 -5.25,1.525; 3 -4.75,1.525; 4 -4.25,1.525; 5 -3.75,1.525; 6 -3.25,1.525; 7 -2.75,1.525; 8 -2.25,1.525; 9 -1.75,1.525; 10 -1.25,1.525; 11 -0.75,1.525; 12 -0.25,1.525; 13 0.25,1.525; 14 0.75,1.525; 15 1.25,1.525; 16 1.75,1.525; 17 2.25,1.525; 18 2.75,1.525; 19 3.25,1.525; 20 3.75,1.525; 21 4.25,1.525; 22 4.75,1.525; 23 5.25,1.525; 24 5.75,1.525 | smd 0.3 x 1: MP1 -6.54,-1.125; MP2 6.54,-1.125
TC2030-IDC_TC2030IDC = smd 0.783 x 0.783: 1 -0.953,-0.635; 2 -0.953,0.635; 3 0.317,-0.635; 4 0.317,0.635; 5 1.588,-0.635; 6 1.588,0.635 | hole 2.451: -2.223,-2.54; -2.223,2.54; 0.952,-2.54; 0.952,2.54 | hole 1.067: -2.223,0; 2.857,-1.016; 2.857,1.016
KH-TYPE-C-16P_KINGHELM_KH-TYPE-C-16P = smd 0.6 x 1.15: A1_B12 -3.2,4.725; A4_B9 -2.4,4.725; A9_B4 2.4,4.725; A12_B1 3.2,4.725 | smd 0.3 x 1.15: A5 -1.25,4.725; A6 -0.25,4.725; A7 0.25,4.725; A8 1.25,4.725; B5 1.75,4.725; B6 0.75,4.725; B7 -0.75,4.725; B8 -1.75,4.725 | drill 0.65 pad 1.05: SH1 -4.32,0; SH2 4.32,0; SH3 -4.32,4.15; SH4 4.32,4.15 | hole 0.7: -2.89,3.65; 2.89,3.65
NORDIC_NRF_2_RESC0201_N = smd 0.4 x 0.45: 1 -0.305,0; 2 0.305,0
NORDIC_NRF_2_RESC0603_N = smd 1.05 x 0.9: 1 -0.8,0; 2 0.8,0
NORDIC_NRF_2_RESC0402_N = smd 0.6 x 0.6: 1 -0.55,0; 2 0.55,0
ESP32_C6_LIBRARY_2_IND_4828-WE-TPC_WRE = smd 0.9 x 5.3: 1 -2.286,0; 2 2.286,0
FTC252012SR47MBCA = smd 1.079 x 2.129: 1 -1.125,0; 2 1.125,0
ESP32_C6_LIBRARY_4_ESP32_C6_LIBRARY_4_ESP32_C6_LIBRARY_4_ESP32_C6_LIBRARY_4_ESP32_WROVER_SPARKFUN-DISCRETESEMI_SOT23-3 = smd 0.8 x 0.9: 1 -0.95,-1; 2 0.95,-1; 3 0,1.1
ESP32_C6_LIBRARY_6_SOT65P210X110-3N = smd 1.05 x 0.5: 1 -1.05,0.65; 2 -1.05,-0.65; 3 1.05,0
ERA-1AEB3401C_0201 = smd 0.35 x 0.25: 1 0,0.275; 2 0,-0.275
ESP32_C6_LIBRARY_7_JUMPER_SJ = smd 1.168 x 1.6: 1 -0.762,0; 2 0.762,0
2025-10-22_07-23-44_LIBRARY_SW_EVP-AKE31A_PAN = smd 0.711 x 1.092: 1 -1.4,-0.972; 2 1.4,-0.972 | drill 0.559 pad 0.914 square: 3 -1.848,0.381; 4 1.848,0.381 | smd 1.397 x 1.092: 5 0,-1.124
HECTOR_WATCH_1_TP20R = smd 2 x 2: TP 0,0
NORDIC_NRF_4_AQFN50P700X700X85_HS-74N = smd 4.85 x 4.85: P$74 0,0 | drill 0.3 pad 0.6: P$75 -1.8,1.8; P$76 -0.6,1.8; P$77 0.6,1.8; P$78 1.8,1.8; P$79 -1.8,0.6; P$80 -0.6,0.6; P$81 0.6,0.6; P$82 1.8,0.6; P$83 -1.8,-0.6; P$84 -0.6,-0.6; P$85 0.6,-0.6; P$86 1.8,-0.6; P$87 -1.8,-1.8; P$88 -0.6,-1.8; P$89 0.6,-1.8; P$90 1.8,-1.8 | smd 0.2 x 0.2: P$A8 -1.25,3.25; P$A10 -0.75,3.25; P$A12 -0.25,3.25; P$A14 0.25,3.25; P$A16 0.75,3.25; P$A18 1.25,3.25; P$A20 1.75,3.25; P$A22 2.25,3.25; P$A23 2.75,3.25; P$AA24 3.25,-2.25; P$AB2 -2.75,-2.5; P$AC5 -2,-2.75; P$AC9 -1,-2.75; P$AC11 -0.5,-2.75; P$AC13 0,-2.75; P$AC15 0.5,-2.75; P$AC17 1,-2.75; P$AC19 1.5,-2.75; P$AC21 2,-2.75; P$AC24 3.25,-2.75; P$AD2 -2.75,-3.25; P$AD4 -2.25,-3.25; P$AD6 -1.75,-3.25; P$AD8 -1.25,-3.25; P$AD10 -0.75,-3.25; P$AD12 -0.25,-3.25; P$AD14 0.25,-3.25; P$AD16 0.75,-3.25; P$AD18 1.25,-3.25; P$AD20 1.75,-3.25; P$AD22 2.25,-3.25; P$AD23 2.75,-3.25; P$B1 -3.25,2.75; P$B3 -2.5,2.75; P$B5 -2,2.75; P$B7 -1.5,2.75; P$B9 -1,2.75; P$B11 -0.5,2.75; P$B13 0,2.75; P$B15 0.5,2.75; P$B17 1,2.75; P$B19 1.5,2.75; P$B24 3.25,2.75; P$C1 -3.25,2.25; P$D2 -2.75,2; P$D23 2.75,2; P$E24 3.25,1.75; P$F2 -2.75,1.5; P$F23 2.75,1.5; P$G1 -3.25,1.25; P$H2 -2.75,1; P$H23 2.75,1; P$J1 -3.25,0.75; P$J24 3.25,0.75; P$K2 -2.75,0.5; P$L1 -3.25,0.25; P$L24 3.25,0.25; P$M2 -2.75,0; P$N1 -3.25,-0.25; P$N24 3.25,-0.25; P$P2 -2.75,-0.5; P$P23 2.75,-0.5; P$R1 -3.25,-0.75; P$R24 3.25,-0.75; P$T2 -2.75,-1; P$T23 2.75,-1; P$U1 -3.25,-1.25; P$U24 3.25,-1.25; P$V23 2.75,-1.5; P$W1 -3.25,-1.75; P$W24 3.25,-1.75; P$Y2 -2.75,-2; P$Y23 2.75,-2
ESP32_C6_LIBRARY_SON50P200X200X80-9N = smd 0.76 x 0.27: 1 -0.985,0.75; 2 -0.985,0.25; 3 -0.985,-0.25; 4 -0.985,-0.75; 5 0.985,-0.75; 6 0.985,-0.25; 7 0.985,0.25; 8 0.985,0.75 | smd 0.9 x 1.3: 9 0,0
NORDIC_NRF_BT-XTAL_2016_N = smd 0.95 x 0.85: 1 -0.725,-0.575; 2 0.725,-0.575; 3 0.725,0.575; 4 -0.725,0.575
NORDIC_NRF_1_XTAL_3215_N = smd 1 x 1.8: 1 -1.25,0; 2 1.25,0

### Placement (x,y rotation side)
ANT1  41.8,3.5 270 top
C1  39.75,15.5 0 top
C1-EP-DR  19.9,16.2 0 top
C2  37.8,18 90 top
C2-EP-DR  20.8,9.7 90 top
C3  40.7,8.8 0 top
C4  40.7,8 0 top
C5  31.5,14.9 270 top
C6  30.9,10.1 180 top
C7  35.85,7.45 90 top
C8  39.2,8.7 180 top
C9  39.45,11.25 90 top
C10  41.4,15.5 180 top
C11  39.75,14.7 180 top
C12  37.7,16.52 270 top
C13  35.54,16.02 0 top
C14  31.8,17.5 90 top
C15  35.5,18.15 0 top
C16  35.18,17.23 180 top
C17  28.2,14.75 90 top
C18  28.2,13.15 270 top
C19  25.33,8.95 270 top
C20  31.1,7.7 90 top
C21  32.6,6.9 270 top
C22  42.9,8.01 180 top
C23  17.2,30.77 90 top
C24  17.21,32.78 270 top
C25  11.5,29.9 270 top
C27  40.2,26.3 0 top
C29  30.9,2.7 90 top
C30  9.05,2.8 90 top
C31  20.05,2.8 90 top
C32  5.1,25.7 0 top
C33  9.95,29.9 270 top
C34  5.6,29 180 top
C37  44.2,29.3 0 top
C38  39.4,31.1 270 top
C39  40.2,33.1 0 top
C42  28.45,26.8 90 top
C43  27.5,27.08 90 top
D2  17.2,8.9 180 top
D3  25.4,23.5 270 top
D4  17.2,5.3 0 top
D5  18.3,12.5 0 top
EPD_C1  13.1,20.1 180 top
EPD_C2  13.1,21.2 180 top
EPD_C5  13.3,17.4 270 top
EPD_C6  13.1,15.5 180 top
EPD_C7  13.1,14.4 180 top
EPD_C8  13.1,13.3 180 top
EPD_C9  15,13.4 270 top
EPD_C10  13.1,11.5 180 top
EPD_C11  14,7.8 90 top
EPD_C12  13.1,10.4 180 top
IC1  41.8,31.4 90 top
IC2  4.6,27.6 180 top
IC3  27.1,8.4 90 top
IC9  14.3,31.6 270 top
J1  9.1,17.5 270 top
J2  33.8,27.8 90 top
J4  23,33.7 180 top
L1  41.8,8.3 270 top
L2  33.1,17.1 90 top
L3  33.85,19.25 0 top
L5  20,19.9 180 top
L7  14.3,28.6 180 top
Q1  16.6,16 0 top
Q3  19.1,24.2 0 top
R1_EP_DR  15.2,23.65 180 top
R1_USB  24.25,27.7 180 top
R2  11.7,32.6 90 top
R2_EP_DR  16.9,25.3 0 top
R2_USB  21.25,27.7 0 top
R3  29,7.6 270 top
R4  13.9,33.6 0 top
R5  8.3,3.1 0 top
R7  30.1,3.1 0 top
R8  19.3,3.1 0 top
R9  42.3,29.6 90 top
R17  13.3,33.6 180 top
R18  11.7,33.1 270 top
R_PWR_EPD  16.6,14.9 90 top
R_TYPE_SEL  16,23.35 270 top
SJ1  15.45,21.55 90 top
SW_DN  34,3.3 180 top
SW_ENT  23,3.3 180 top
SW_UP  12,3.3 180 top
TP_3.3V  1.6,9 0 top
TP_3V3  6.4,33.5 0 top
TP_BAT_GND  44.67,23.66 180 bottom
TP_GND  1.6,5.9 0 top
TP_ON  1.7,29.5 180 bottom
TP_OP  1.6,25.9 180 bottom
TP_RESET  44.6,11.7 0 top
TP_SCL  1.7,29.5 0 top
TP_SDA  1.6,25.9 0 top
TP_SWDCLK  44.7,14.9 0 top
TP_SWDIO  44.7,18.1 0 top
TP_SWO  44.7,21.3 0 top
TP_VBAT  44.7,26.9 180 bottom
TP_VREG  9.6,33.5 0 top
U1  35.5,12.1 0 top
U3  41,24 270 top
X1  39.5,17.4 90 top
X2  29.8,14 270 top

### Tracks (layer width: path | path; a pad name or v marks a point on that pad's centre or on a via)
3V3  (via drill 0.3, 0.35)
  Top 0.15: R8.2 v19.3,2.3 | R5.2 v8.3,2.3 | v28.4,9.6 28.38,9.57 28.38,8.95 28.07,8.65 IC3.3 | R7.2 v30.1,2.3 | IC3.10 25.95,7.65 25.8,7.8 25.8,8.5 25.8,9 25.95,9.15 IC3.7 | IC2.C2 v4.6,29 C34.2 | R18.1 12.3,33.1 v12.6,33.4 12.68,33.33 R17.1
  Top 0.2: 35.85,8.05 C7.2 36.1,8 | v25.35,8 25.33,8.02 25.33,8.4 | 25.33,8.4 25.33,8.5 | 25.33,8.5 25.33,8.6 | 25.33,8.6 C19.2 | 25.33,8.5 25.5,8.5 | 25.5,8.5 25.8,8.5 | 25.33,8.4 25.4,8.4 25.5,8.5 | 25.33,8.6 25.4,8.6 25.5,8.5
  Top 0.3: R_PWR_EPD.2 17.45,14.9 Q1.2 v18.5,15 | J2.1 34.7,26.58 v34.7,23.1 | U1.P$B1 32.25,15.35 31.8,15.8 C14.1 v30.9,17 | 31.4,10 C6.1 31.65,10.35 U1.P$W1 | 31.4,10 v31.4,9.2 | U1.P$Y2 31.5,10.1 31.4,10 | TP_3.3V.TP v3.3,9 | U1.P$AD14 35.75,8.15 35.85,8.05 35.9,8 36.1,8 v37,8 | 13.1,31.6 IC9.E3 IC9.E2 13.1,31.6 | v11.45,31.8 12.9,31.8 13.1,31.6 | TP_3V3.TP 8.1,31.8 v9.95,31.8 | U1.P$AD23 38.74,8.85 C8.2 38.89,8.05 v39.05,7.9 | U1.P$A22 37.7,15.4 C12.2 37.09,16.21 v36.8,16.5
  pour Top: 9.6,32.1 11.8,32.1 11.9,32 11.9,31.6 11.8,31.5 9.6,31.5 9.5,31.6 9.5,32
  pour Power (rank 2): -0.2,35.2 46.1,35.2 46.1,-0.8 -0.2,-0.8
ALERT  (via drill 0.2, 0.3)
  Top 0.15: U1.P$J24 38.35,12.45 v38.35,12.1 | v42.2,19.7 v42.2,17 | v40.2,21.9 40.2,22.96 U3.5
  Bottom 0.15: v38.35,12.1 40.2,12.1 42.2,14.1 v42.2,17 | v42.2,19.7 40.2,21.7 v40.2,21.9
DEC4_6  (via drill 0.3)
  Top 0.15: U1.P$B5 33.5,15.05 34.4,15.95 34.4,17 | U1.P$E24 39.1,14.2 40.5,14.2 v41.1,14.8 C10.2 | v35.2,19.15 34.5,19.15 L3.2 34.4,18.6 | 34.4,17 34.4,17.2 | 34.4,17.2 34.4,17.4 | 34.4,17.4 34.4,17.7 | 34.4,17.7 34.4,17.8 | 34.4,17.8 34.4,18 | 34.4,18 34.4,18.1 | 34.4,18.1 34.4,18.5 | 34.4,18.5 34.4,18.6 | C16.2 34.84,17.2 34.4,17.2 | 34.75,18.15 34.4,17.8 | C15.1 34.75,18.15 | 34.75,18.15 34.4,18.5 | C15.1 34.45,18.15 34.4,18.1 | C15.1 34.55,18.15 34.4,18 | 34.85,18.15 34.4,17.7 | C15.1 34.85,18.15 | 34.85,18.15 34.4,18.6 | C16.2 34.57,17.23 34.4,17.4 | C16.2 34.63,17.23 34.4,17
  Bottom 0.15: v41.1,14.8 39.55,14.8 v35.2,19.15
DIN_N
  Top 0.15: J4.B7 23.75,28.25 23.6,28.1 22.9,28.1 22.75,28.25 J4.A7 22.75,28.1 22.64,27.99 22.64,27.46 24,26.1 25.4,26.1 26.35,25.15 D3.1
DIN_P
  Top 0.15: J4.A6 23.25,29.75 23.1,29.9 22.4,29.9 22.25,29.75 J4.B6 22.25,28.1 22.36,27.99 22.36,27.35 23.89,25.82 24.1,25.82 24.45,25.47 D3.3
DOUT_N  (via drill 0.2)
  Top 0.15: U1.P$AD4 33.25,8.52 v33.13,8.4 | v23.95,7.05 23.4,7.6 23.4,14.4 25.54,16.54 25.54,20.76 26.35,21.57 D3.6
  Bottom 0.15: v33.13,8.4 31.63,6.9 24.1,6.9 v23.95,7.05
DOUT_P  (via drill 0.2)
  Top 0.15: U1.P$AD6 33.75,8.52 v33.87,8.4 | v23.43,6.53 23.12,6.84 23.12,14.52 25.26,16.65 25.26,20.76 24.45,21.57 D3.4
  Bottom 0.15: v33.87,8.4 32.09,6.62 24.7,6.62 24.61,6.53 v23.43,6.53
EPD_3V3
  Top 0.3: J1.16 J1.15 12.9,16.25 | 17.71,18.8 L5.2 | 12.9,16.25 13.3,16.25 | 13.3,16.25 13.7,16.25 | 13.7,16.25 14.06,16.25 15.51,17.7 | 13.3,16.25 EPD_C5.2 13.3,16.65 | 13.3,16.65 12.9,16.25 | 13.3,16.65 13.7,16.25 | 15.51,17.7 15.76,17.94 | 15.76,17.94 16,18.19 | 16,18.19 16.61,18.8 17.4,18.8 | 17.4,18.8 17.71,18.8 | 17.71,18.8 17.85,18.8 17.85,16.93 | Q1.3 16,17.7 | 16,17.7 15.76,17.94 | 16,17.7 16,18.19 | 16,17.7 15.51,17.7 | C1-EP-DR.1 18.4,16.2 17.85,16.75 17.85,16.93 | 17.85,16.93 17.4,18.8
EPD_BUSY  (via drill 0.3)
  Top 0.15: U1.P$AD12 35.35,8.75 35.35,7.9 34.55,7.1 v34.35,7.1 | v8.4,19.3 10.57,19.3 J1.9
  Bottom 0.15: v34.35,7.1 33.9,7.1 32.4,5.6 13.7,5.6 7.45,11.85 7.45,18.75 8,19.3 v8.4,19.3
EPD_CS  (via drill 0.2, 0.3)
  Top 0.15: v9.9,17.5 10.15,17.75 J1.12
  Bottom 0.15: U1.P$K2 32.7,12.65 18.05,12.65 14.7,16 10.3,16 9.9,16.4 v9.9,17.5
  other vias: 32.75,12.6
EPD_DC  (via drill 0.3)
  Top 0.15: U1.P$AD10 34.6,8.7 v34.6,7.9
  Top 0.152: J1.11 8.7,18.25 v8.65,18.2
  Bottom 0.15: v8.65,18.2 8.4,18.2 8,17.8 8,12 13.9,6.1 32.2,6.1 33.7,7.6 34.3,7.6 v34.6,7.9
EPD_RST  (via drill 0.2, 0.3)
  Top 0.15: v8.6,17.15 8,17.75 8,18.5 8.25,18.75 J1.10
  Bottom 0.15: U1.P$AC11 34.75,9.6 33.3,9.6 31.25,7.55 23.4,7.55 22.5,6.65 14.25,6.65 8.6,12.3 v8.6,17.15
  other vias: 35,9.35
GDR
  Top 0.15: J1.2 11.15,22.75 13.25,24.85 16.9,24.85 | R2_EP_DR.2 16.9,24.85 | Q3.1 16.9,24.85
GND  (via drill 0.2, 0.3, 0.35)
  Top 0.15: 35,27.5 35,27.55 J2.3 J2.5 34.69,29.39 35.2,29.9 | U1.P$F23 37.6,13.6 U1.P$78 | U1.P$75 34,14.2 U1.P$B7
  Top 0.3: IC9.C3 IC9.C2 IC9.C1
  Bottom 0.3: TP_BAT_GND.TP 44.67,23.75 v42.95,23.75
  other vias: 38.25,7.45 39.75,7.45 41.1,7.45 42.55,7.45 43.9,7.45 45.25,7.45 36.55,7.4 36.25,5.8 36.25,4.05 27.2,8.4 29,10.1 38.2,14.85 41.3,18.2 40.3,19.2 31.2,16.1 29.6,16.4 42.4,9.9 42.4,11.5 41.5,12.5 39.4,13.7 40.5,13.4 39.5,12.6 40.4,11.7 41.1,10.9 41.2,9.9 28.2,3 24.6,8.4 35.5,12.1 1.75,27.45 40.8,28.2 38.2,30.5 37.2,33.6 35.4,33.6 33.6,33.6 31.8,33.6 30,33.6 24.6,33.6 22.8,33.6 21,33.6 4.8,33.6 24.6,31.8 22.8,31.8 21,31.8 6.6,31.8 4.8,31.8 3,31.8 44.4,30 33.6,30 30,30 8.4,30 6.6,30 19.2,28.2 17.4,28.2 12,28.2 10.2,28.2 8.4,28.2 42.6,26.4 21,26.4 19.2,26.4 17.4,26.4 15.6,26.4 13.8,26.4 12,26.4 10.2,26.4 42.6,24.6 33.6,24.6 22.8,24.6 21,24.6 19.2,24.6 12,24.6 42.6,22.8 35.4,22.8 31.8,22.8 28.2,22.8 13.8,22.8 8.4,22.8 42.6,21 30,21 28.2,21 26.4,21 19.2,21 8.4,21 39,19.2 37.2,19.2 28.2,19.2 26.4,19.2 24.6,19.2 21,19.2 19.2,19.2 13.8,19.2 12,19.2 40.8,17.4 26.4,17.4 24.6,17.4 24.6,13.8 21,13.8 19.2,13.8 24.6,12 21,12 26.4,10.2 24.6,10.2 17.4,10.2 15.6,10.2 8.4,10.2 17.4,8.4 10.2,8.4 8.4,8.4 6.6,8.4 4.8,8.4 28.2,1.2 26.4,1.2 19.2,1.2 17.4,1.2 15.6,1.2 8.4,1.2 6.6,1.2 4.8,1.2 30,1.2 3,3 4.8,3 6.6,3 12,3 15.6,3 17.4,3 22.8,3 26.4,3 33.6,3 3,4.8 4.8,4.8 6.6,4.8 8.4,4.8 3,6.6 4.8,6.6 6.6,6.6 8.4,6.6 10.2,6.6 12,6.6
  pour Top (rank 2): -0.2,35.2 46.1,35.2 46.1,-0.8 -0.2,-0.8
  pour GND (rank 2): -0.2,35.2 46.1,35.2 46.1,-0.8 -0.2,-0.8
HAPTIC_EN  (via drill 0.3)
  Top 0.15: IC2.A1 v5.6,26.6 | U1.P$U1 29.55,10.85 v29.4,10.7
  Bottom 0.15: v29.4,10.7 25.8,10.7 22.3,7.2 14.6,7.2 9.3,12.5 9.3,22.9 v5.6,26.6
IMU_INT1
  Top 0.15: IC3.5 27.35,9.65 28.85,11.15 31.55,11.15 U1.P$N1
IMU_INT2  (via drill 0.2)
  Top 0.15: v26.85,9.7 IC3.6
  Bottom 0.15: U1.P$P2 33.05,11.3 33.05,10.2 30.85,8 28.65,8 26.95,9.7 v26.85,9.7
  other vias: 32.75,11.6
LX1
  Top 0.2: 14.7,30.7 IC9.B3 IC9.B2
  Top 0.3: 14.7,30.7 15.43,29.98 L7.1
LX2
  Top 0.2: 13.9,30.7 IC9.D3 IC9.D2
  Top 0.3: 13.9,30.7 13.18,29.98 L7.2
MOSI  (via drill 0.2, 0.3)
  Top 0.15: v12.3,17.3 11.75,16.75 J1.14
  Bottom 0.15: U1.P$B13 19.95,14.85 17.5,17.3 v12.3,17.3
  other vias: 35.5,14.85
N$1
  Top 0.15: J4.A5 R1_USB.2
N$2
  Top 0.15: J1.24 11.05,11.75 11.3,11.5 11.3,11.1 12,10.4 EPD_C12.2
N$3
  Top 0.15: U1.P$D2 32.65,14 31.05,14 X2.1 29.61,15.05 C17.2
N$4
  Top 0.15: J1.4 11.45,21.75 12,21.2 EPD_C2.2
N$5
  Top 0.2: U1.P$AC5 33.4,9.25 32.45,9.25 31.9,8.7 31.9,8 C20.1
N$6
  Top 0.15: J1.5 11.25,21.25 11.7,20.8 11.7,20.3 11.9,20.1 EPD_C1.2
N$7
  Top 0.15: J1.22 11.35,12.75 EPD_C10.2
N$8
  Top 0.15: J4.B5 R2_USB.1
N$9
  Top 0.15: IC2.A2 C32.1
N$10
  Top 0.15: J1.20 11.55,13.75 12,13.3 EPD_C8.2
N$11
  Top 0.15: J1.19 12.45,14.25 EPD_C7.2
N$12
  Top 0.15: J1.18 11.25,14.75 12,15.5 EPD_C6.2
N$13
  Top 0.3: C2-EP-DR.2 20.05,10.95 D5.2 20.05,14.15 22.29,16.39 L5.1 22.29,22.06 Q3.3
N$14
  Top 0.3: D4.2 D2.1 20.5,8.9 C2-EP-DR.1
N$15
  Top 0.15: R4.2 IC9.D1
N$16
  Top 0.15: U1.P$F2 32.65,13.7 30.75,13.7 29.93,12.88 29.89,12.84 | 29.89,12.84 X2.2 29.6,12.95 | C18.2 29.89,12.84
N$17
  Top 0.15: U1.P$C1 31.87,14.35 C5.2
N$18
  Top 0.3: 15.5,23.38 R1_EP_DR.1 15.22,23.38 15.5,23.1 | 15.5,23.38 15.7,23.38 R_TYPE_SEL.2 15.5,23.12 | 15.5,23.38 15.5,23.12 | 15.5,23.1 15.5,22.36 SJ1.2 | 15.5,23.1 15.5,23.12
N$19
  Top 0.15: R3.2 27.93,7.6 IC3.1
N$20
  Top 0.15: IC9.E1 12.9,32.6 R2.2
N$21
  Top 0.15: L2.2 33.1,19.02 L3.1
N$22
  Top 0.15: U1.P$A23 38.25,17.25 | X1.3 38.92,17.93 38.25,17.25 | 38.25,17.25 38.12,17.32 37.8,17.5 C2.1
N$24
  Top 0.15: IC1.D1 42.58,31.02 R9.2
N$25
  Top 0.15: 35.84,16.16 C13.2 36.18,16.02 36.75,15.45 U1.P$A18
N$26
  Top 0.15: L2.1 33.1,14.95 U1.P$B3
N$27
  Top 0.15: U1.P$D23 38.45,14.1 39.05,14.7 C11.2
N$28
  Top 0.15: 39.47,15.5 C1.1 | U1.P$B24 39.4,15.5 C1.1 | C1.1 39.45,15.85 40.08,16.48 X1.1
N$30
  Top 0.15: U1.P$N24 38.75,11.84 39.15,11.43 C9.2
N$32
  Top 0.15: C3.2 40.84,8.87 L1.1 41.8,11.2 39.8,13.2 38.35,13.2 U1.P$H23
N$33
  Top 0.15: L1.2 C4.2 | C22.2 L1.2 | ANT1.1 L1.2
OUT+  (via drill 0.3)
  Top 0.15: IC2.A3 3.3,26.3 v3.1,26.3
  Bottom 0.15: v3.1,26.3 2.7,25.9 TP_OP.TP
OUT-  (via drill 0.3)
  Top 0.15: IC2.C3 v2.3,28.1
  Bottom 0.15: v2.3,28.1 1.7,28.7 TP_ON.TP
P0.13  (via drill 0.3)
  Top 0.15: v9.4,4 9.67,4.27 SW_UP.2 | U1.P$AD8 34.25,8.2 33.75,7.7 33.75,6.55 v33.9,6.4 | R5.1 8.93,4 v9.4,4 | C30.2 v9.4,4
  Bottom 0.15: v9.4,4 9.9,4.5 27.4,4.5 28,5.1 32.6,5.1 v33.9,6.4
P0.14  (via drill 0.2, 0.3)
  Top 0.15: SW_ENT.2 20.67,4.27 v20.4,4 | U1.P$AC9 34.35,9.2 v34,9.2 | R8.1 19.93,4 v20.4,4 | C31.2 v20.4,4
  Bottom 0.15: v20.4,4 27.7,4 28.3,4.6 32.85,4.6 35.1,6.85 35.1,8.2 34.1,9.2 v34,9.2
P1.01  (via drill 0.3, 0.35)
  Top 0.15: v14.7,15 Q1.1 15.75,14.9 R_PWR_EPD.1 | v34.35,5.4 34.15,5.2 22.1,5.2 20.85,6.45 v20.85,8 | U1.P$Y23 38.25,9.5 v38.1,9.35
  Bottom 0.15: v34.35,5.4 34.4,5.4 35.6,6.6 35.6,7.9 37.05,9.35 v38.1,9.35 | v20.85,8 14.7,14.15 v14.7,15
P1.02  (via drill 0.35)
  Top 0.15: SW_DN.2 31.67,4.27 v31.4,4 | v39.45,10.35 U1.P$W24 | R7.1 30.73,4 v31.4,4 | C29.2 v31.4,4
  Bottom 0.15: v31.4,4 33.7,4 36.1,6.4 36.1,7.8 37.15,8.85 38.45,8.85 38.7,9.1 38.7,9.6 v39.45,10.35
PMIC_INT  (via drill 0.2, 0.3)
  Top 0.15: U1.P$T2 32.75,10.7 v32.65,10.6 | 24,14.2 31.9,22.1
  Top 0.152: v30.3,8.6 30.3,7.3 29.6,6.6 25.5,6.6 24,8.1 24,14.2 | 31.9,22.1 36.9,22.1 38.7,23.9 38.7,28.7 IC1.A1
  Bottom 0.15: v32.65,10.6 31.6,10.6 30.3,9.3 v30.3,8.6
PREVGH
  Top 0.3: J1.21 11.45,13.25 12.3,12.4 14.5,12.4 | 14.5,12.4 15,12.4 | 15,12.4 15.5,12.4 | 15.5,12.4 16.45,12.4 D5.1 | EPD_C9.2 15,12.4 | EPD_C9.2 14.5,12.4 | EPD_C9.2 15.5,12.4
PREVGL
  Top 0.3: J1.23 9.95,12.25 9.8,12.1 9.8,11.3 12.2,8.9 13.4,8.9 | 13.4,8.9 14,8.9 | 14,8.9 14.5,8.9 | 14.5,8.9 D2.2 | EPD_C11.2 14,8.9 | EPD_C11.2 13.4,8.9 | EPD_C11.2 14,8.4 14.5,8.9
RESE
  Top 0.3: J1.3 11.95,22.25 13.62,23.93 R1_EP_DR.2 16.68,23.93 17.05,23.55 Q3.2
RESET  (via drill 0.2, 0.3)
  Top 0.15: J2.6 32.81,29.39 31.6,30.6 v29.2,30.6 | TP_RESET.TP 44.1,12.2 43.7,12.2 v41.65,14.25
  Bottom 0.15: U1.P$AC13 35.8,9.65 37.7,9.65 37.95,9.9 37.95,14 | 37.95,14.35 28.4,23.9 28.4,30.1 28.9,30.6 v29.2,30.6 | v41.65,14.25 41.6,14.2 38.1,14.2 | 38.1,14.2 37.95,14.35 | 38.1,14.2 37.95,14 | 37.95,14 37.95,14.35
  other vias: 35.5,9.35
SCK  (via drill 0.2, 0.3)
  Top 0.15: v11.9,17.9 11.25,17.25 J1.13
  Bottom 0.15: U1.P$A12 35.05,15.55 20.35,15.55 18,17.9 v11.9,17.9
  other vias: 35.25,15.35
SCL  (via drill 0.2, 0.3)
  Top 0.15: v6.3,28.1 IC2.C1 | v29.8,9.3 29.8,7.4 29.45,7.05 27.55,7.05 27.35,7.25 IC3.12 | v25.4,12.1 25.4,14.4 v27.2,16.2 32.1,21.1 39,21.1 | 39,21.1 39.2,21.1 | 39.2,21.1 39.4,21.1 | 39.4,21.1 40.9,21.1 41.25,21.45 U3.7 | IC1.B1 41.6,31.1 39.2,28.7 39.2,21.3 | 39.2,21.1 39.2,21.3 | 39,21.1 39.2,21.3 | 39.2,21.3 39.4,21.1 | R17.2 R4.1 14.03,33.88 14.4,33.5 v14.4,32.9 | TP_SCL.TP 1.9,29.7 4.7,29.7 v4.75,29.65
  Bottom 0.15: U1.P$M2 32.4,12.1 32.37,12.07 | 32.37,12.07 29.8,9.5 v29.8,9.3 | 32.37,12.07 32.25,12.3 31.1,12.3 30.9,12.1 v25.4,12.1 | v27.2,16.2 20.6,16.2 18.3,18.5 15.9,18.5 v6.3,28.1 | v14.4,32.9 10.3,28.8 7,28.8 v6.3,28.1 | v6.3,28.1 v4.75,29.65
  other vias: 32.75,12.1
SDA  (via drill 0.2, 0.3)
  Top 0.15: U1.P$L1 31.55,12.35 | 31.55,12.35 31.3,12.1 v31.3,11.7 27,11.7 26.8,11.9 26.8,14.8 32.6,20.6 41.3,20.6 41.74,21.04 | v28.95,8.75 28.95,8.43 28.68,8.15 IC3.2 | IC1.C1 v42,30.25 | 31.55,12.35 31.3,12.6 v31.3,13.15 | 41.74,21.04 41.75,21.05 U3.8 | 41.74,21.04 v41.95,20.75 | R18.2 R2.1 v10.7,32.6 | TP_SDA.TP 2.3,25.2 v3.2,25.2
  Bottom 0.15: v31.3,11.7 28.95,9.35 v28.95,8.75 | v31.3,13.15 18.35,13.15 14.95,16.55 11.85,16.55 10.9,17.5 10.9,22.2 5.5,27.6 IC2.B2 4.55,27.65 | v42,30.25 42,20.75 v41.95,20.75 | v10.7,32.6 6.6,32.6 4,30 4,28.2 4.55,27.65 | v3.2,25.2 4.55,26.55 4.55,27.65
  other vias: 4.6,27.6
SWDCLK  (via drill 0.3)
  Top 0.15: J2.4 32.2,27.15 v29.3,27.15 | v40.1,9.8 40.05,9.85 U1.P$AA24
  Top 0.152: TP_SWDCLK.TP 44.7,15.4 v43.7,16.4
  Bottom 0.15: v40.1,9.8 40.5,9.4 43.6,9.4 43.7,9.5 v43.7,16.4 43.7,16.6 40.1,20.2 33.2,20.2 29.3,24.1 v29.3,27.15
SWDIO  (via drill 0.3)
  Top 0.15: J2.2 32.9,26.58 v32.9,23.1 | U1.P$AC24 v39.5,9.35 | TP_SWDIO.TP 42.9,18.1 v42.85,18.15
  Bottom 0.15: v39.5,9.35 39.95,8.9 43.8,8.9 44.4,9.5 44.4,16.6 v42.85,18.15 40.3,20.7 35.3,20.7 v32.9,23.1
SWO  (via drill 0.3)
  Top 0.15: U1.P$AD22 37.75,8.35 v37.9,8.2 | v45.3,19.7 44.7,20.3 TP_SWO.TP
  Bottom 0.15: v37.9,8.2 38.45,8.2 38.7,8.45 44.25,8.45 45.25,9.45 45.25,19.65 v45.3,19.7
VBAT  (via drill 0.35)
  Top 0.2: IC1.C2 42,31.8 | C27.2 41,26.3 | C27.2 40.7,26.3 41,26.6 | C27.2 40.6,26.3 41,25.9
  Top 0.25: 42,31.8 42.3,32.1
  Top 0.3: U3.3 40.75,25.45 41,25.7 | 41,25.7 41.25,25.45 U3.2 | 41,25.7 41,25.9 41,26.3 41,26.6 41,27.38 42.22,28.6 43,28.6 | 43,28.6 C37.1 43.7,31.5 43.1,32.1 42.3,32.1 | 43,28.6 43.1,28.27 v43.1,27.1
  Bottom 0.3: TP_VBAT.TP 43.3,26.9 v43.1,27.1
VBUS
  Top 0.2: U1.P$AD2 32.6,8.7 C21.1
  Top 0.3: J4.A9_B4 20.6,29.55 21.35,30.3 24.65,30.3 | 24.65,30.3 24.7,30.3 24.99,31.09 25.5,31.6 C38.1 IC1.A2 | 24.65,30.3 25.4,29.55 J4.A4_B9 25.4,27.5 27.05,25.85 27.2,25.85 | D3.5 25.4,23.2 | 25.4,23.2 25.6,23.4 27,23.4 27.6,24 27.6,25.5 | 25.4,23.2 25.2,23.4 23.7,23.4 23.5,23.2 23.5,16.8 22.1,15.4 22.1,6.6 22.9,5.8 31.4,5.8 31.9,6.3 31.9,7.1 32.2,7.4 C21.1 | 28,25.85 28.15,25.85 28.45,26.15 C42.1 | 28,25.85 27.6,25.85 | 27.6,25.85 27.5,25.85 | 27.5,25.85 27.25,25.85 | 27.6,25.85 27.6,25.5 | 27.25,25.85 27.6,25.5 | 27.25,25.85 27.2,25.85 | 27.6,25.5 27.65,25.5 28,25.85 | C43.1 27.5,25.85 | C43.1 27.5,26.15 27.2,25.85 | C43.1 27.5,26.35 28,25.85
VREG
  Top 0.2: 41.6,31.9 IC1.B2
  Top 0.3: 41.6,31.9 41.19,32.31 39.79,32.31 | 39.05,32.45 19.75,32.45 18.9,31.6 17.7,31.6 | 15.1,31.8 IC9.A1 15.1,33.8 14.5,34.4 10.5,34.4 TP_VREG.TP | 15.1,31.8 15.1,31.4 | 15.1,31.4 IC9.A3 | IC9.A2 15.3,31.6 | 15.1,31.8 15.3,31.6 | 15.3,31.6 15.1,31.4 | 39.05,32.45 39.4,32.8 C39.1 39.4,32.7 39.79,32.31 | 39.05,32.45 39.79,32.31 | 15.3,31.6 16.8,31.6 | 16.8,31.6 16.9,31.6 | 16.9,31.6 17.2,31.6 | 17.2,31.6 17.5,31.6 | 17.5,31.6 17.7,31.6 | C24.2 17.21,31.61 17.2,31.6 | 17.2,31.6 C23.2 17.2,31.3 | 17.2,31.3 16.9,31.6 | 17.2,31.3 17.5,31.6 | C24.2 17.21,32.01 16.8,31.6 | C24.2 17.21,32.09 17.7,31.6
(copper drawn outside any net)
  shapes: Bottom area x1, GND area x1, Top area x1

### Text on the board
SilkscreenTop: 3V3 | SCL | VREG | SDA | SWO | SDIO | SCLK | RST | 3V3 | GND
SilkscreenBottom: OUT- | OUT+ | VBAT | GND
NamesTop: L5